# EAGLE design tc_board (EAGLE 9.6.2)

## Sheet 1 of 3
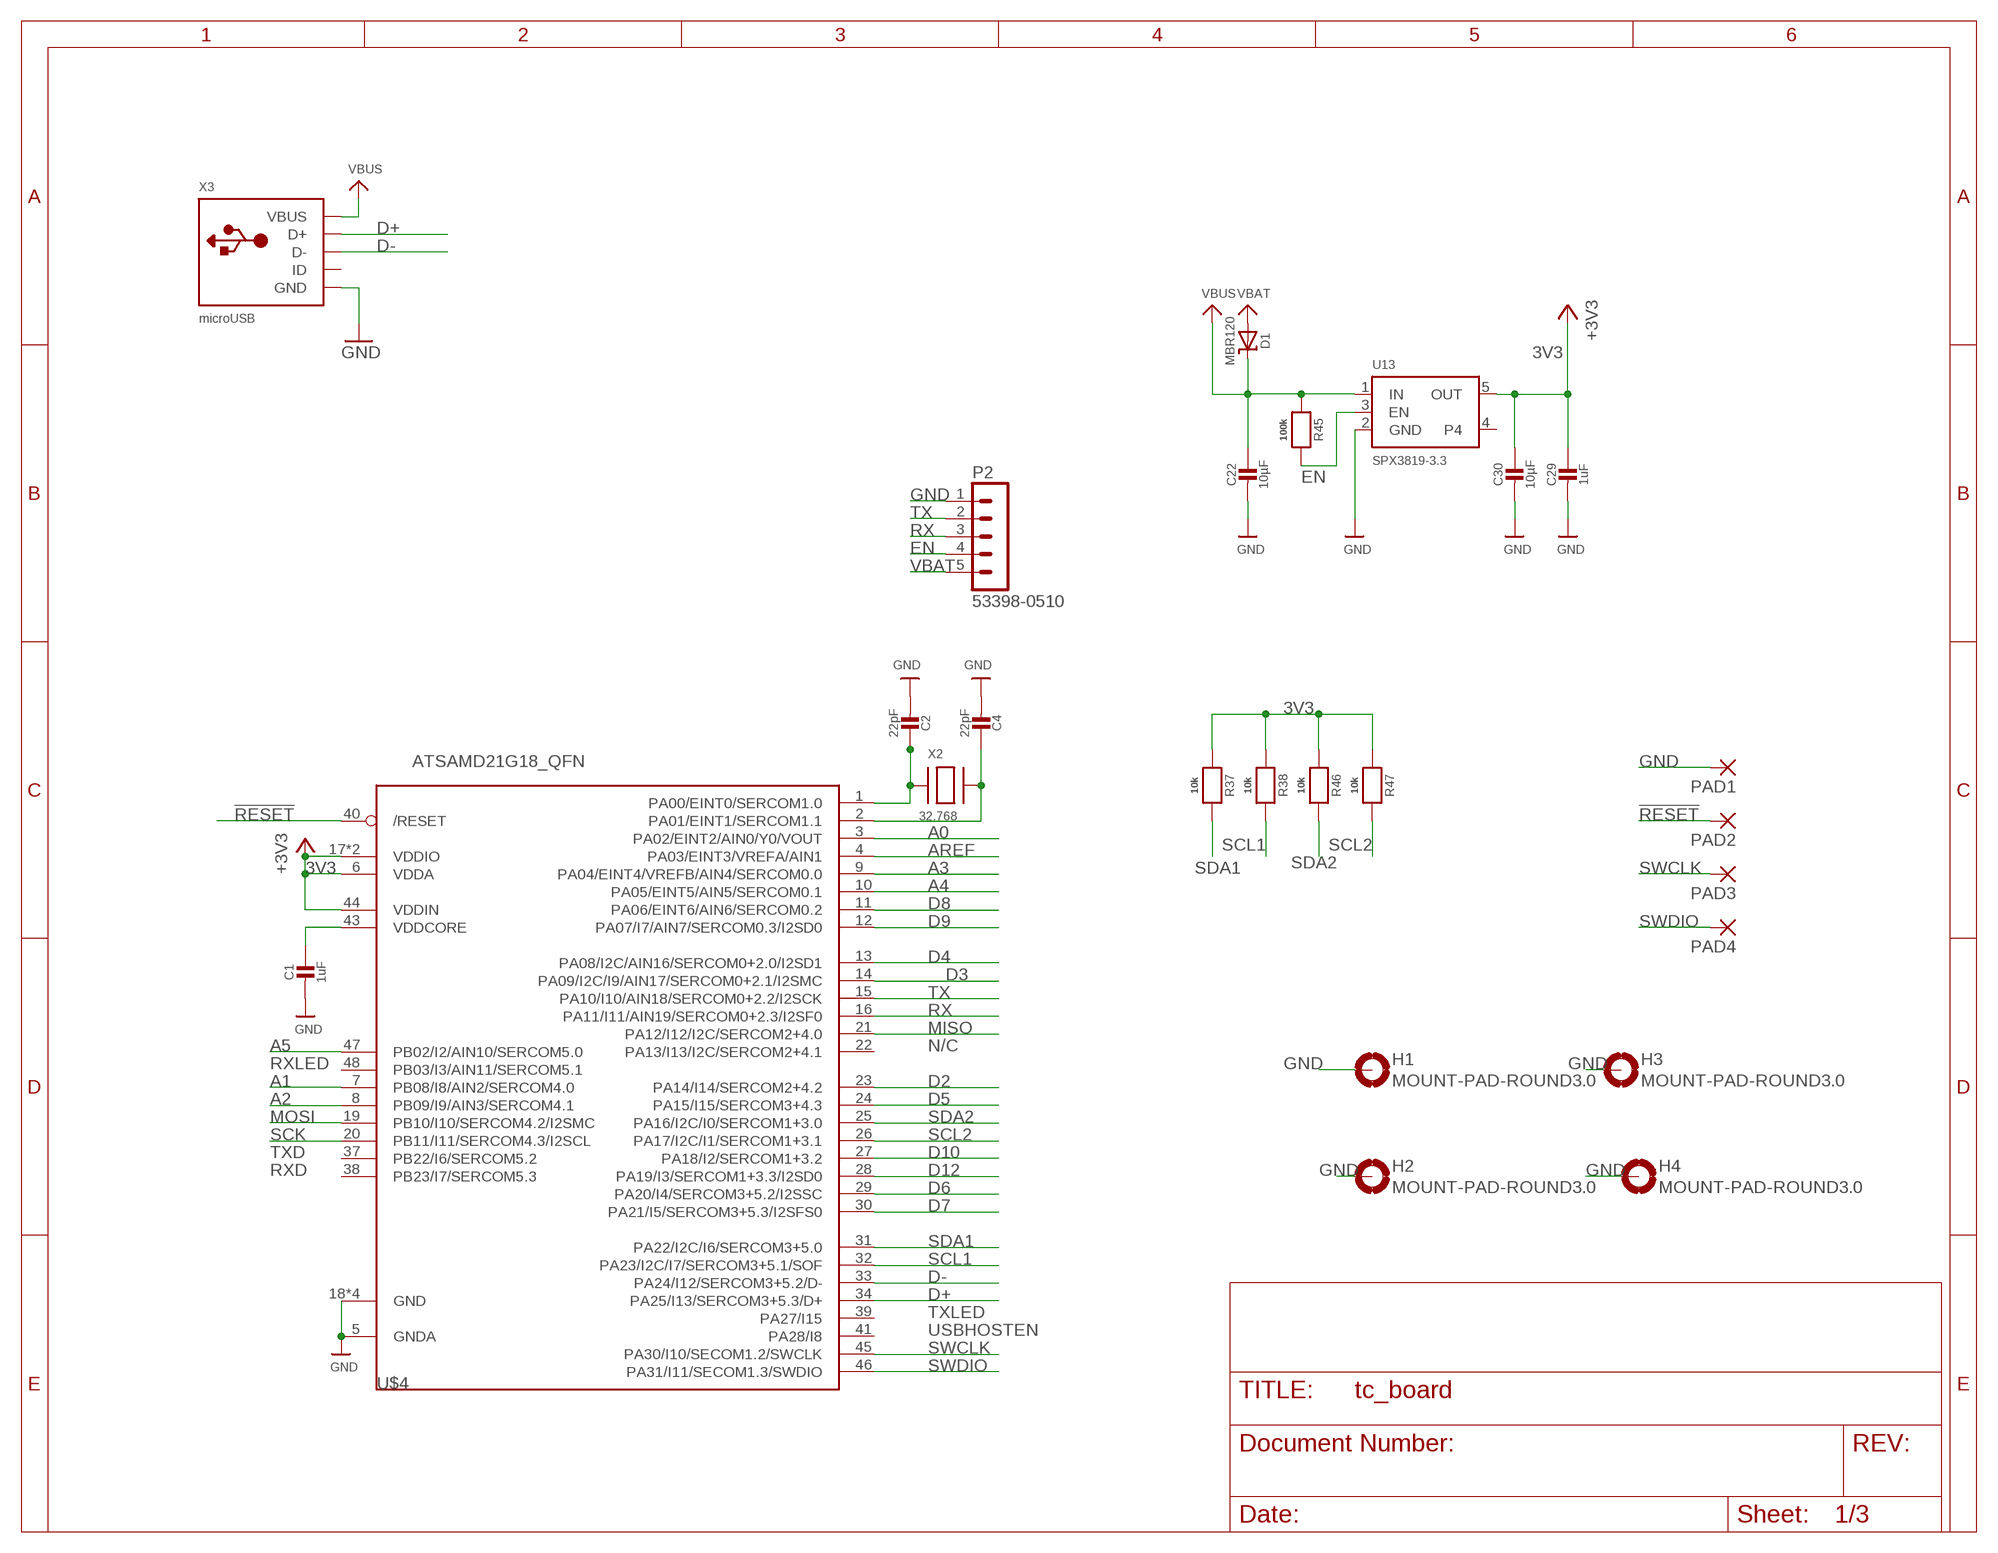
[diagram p0: schematic, sheet 1]

### Parts
C1  1uF  CAP_CERAMIC0603_NO  [0603-NO]
C2  22pF  CAP_CERAMIC0603_NO  [0603-NO]
C4  22pF  CAP_CERAMIC0603_NO  [0603-NO]
C22  10µF  CAP_CERAMIC0805-NOOUTLINE  [0805-NO]
C29  1uF  CAP_CERAMIC0603_NO  [0603-NO]
C30  10µF  CAP_CERAMIC0805-NOOUTLINE  [0805-NO]
D1  MBR120  DIODE-SCHOTTKYSOD-123  [SOD-123]
H1  MOUNT-PAD-ROUND3.0  [3,0-PAD]
H2  MOUNT-PAD-ROUND3.0  [3,0-PAD]
H3  MOUNT-PAD-ROUND3.0  [3,0-PAD]
H4  MOUNT-PAD-ROUND3.0  [3,0-PAD]
P2  53398-0510  [53398-0510]
PAD1  SMD2  [SMD1,27-2,54]
PAD2  SMD2  [SMD1,27-2,54]
PAD3  SMD2  [SMD1,27-2,54]
PAD4  SMD2  [SMD1,27-2,54]
R37  10k  RESISTOR_0603_NOOUT  [0603-NO]
R38  10k  RESISTOR_0603_NOOUT  [0603-NO]
R45  100k  RESISTOR_0603_NOOUT  [0603-NO]
R46  10k  RESISTOR_0603_NOOUT  [0603-NO]
R47  10k  RESISTOR_0603_NOOUT  [0603-NO]
U13  SPX3819-3.3  VREG_SOT23-5  [SOT23-5]
U$4  ATSAMD21G18_QFN  ATSAMD21J_QFN  [TQFN48_7MM]
X2  32.768  XTAL-3.2X1.5  [XTAL3215]
X3  microUSB  USB_MICRO_20329_V2  [4UCONN_20329_V2]

### Nets
3V3: C29.1 C30.1 R37.1 R38.1 R46.1 R47.1 U13.5(OUT) U$4.6(VDDA) U$4.17(VDDIO) U$4.36(VDDIO) U$4.44(VDDIN) ; supply symbol labelled +3V3 ; also sheet 2,3
!RESET: PAD2.1(P) U$4.40(/RESET)
A0: U$4.3(PA02/EINT2/AIN0/Y0/VOUT)
A1: U$4.7(PB08/I8/AIN2/SERCOM4.0)
A2: U$4.8(PB09/I9/AIN3/SERCOM4.1)
A3: U$4.9(PA04/EINT4/VREFB/AIN4/SERCOM0.0)
A4: U$4.10(PA05/EINT5/AIN5/SERCOM0.1)
A5: U$4.47(PB02/I2/AIN10/SERCOM5.0)
AREF: U$4.4(PA03/EINT3/VREFA/AIN1)
D2: U$4.23(PA14/I14/SERCOM2+4.2)
D3: U$4.14(PA09/I2C/I9/AIN17/SERCOM0+2.1/I2SMC)
D4: U$4.13(PA08/I2C/AIN16/SERCOM0+2.0/I2SD1)
D5: U$4.24(PA15/I15/SERCOM3+4.3)
D6: U$4.29(PA20/I4/SERCOM3+5.2/I2SSC)
D7: U$4.30(PA21/I5/SERCOM3+5.3/I2SFS0)
D8: U$4.11(PA06/EINT6/AIN6/SERCOM0.2)
D9: U$4.12(PA07/I7/AIN7/SERCOM0.3/I2SD0)
D10: U$4.27(PA18/I2/SERCOM1+3.2)
D12: U$4.28(PA19/I3/SERCOM1+3.3/I2SD0)
D+: U$4.34(PA25/I13/SERCOM3+5.3/D+) X3.D+
D-: U$4.33(PA24/I12/SERCOM3+5.2/D-) X3.D-
EN: P2.4 R45.2 U13.3(EN)
GND: C1.2 C2.2 C4.2 C22.2 C29.2 C30.2 H1.B3,0(MOUNT) H2.B3,0(MOUNT) H3.B3,0(MOUNT) H4.B3,0(MOUNT) P2.1 PAD1.1(P) U13.2(GND) U$4.5(GNDA) U$4.18(GND) U$4.35(GND) U$4.42(GND) U$4.THERMAL(GND) X3.BASE@1(GND) X3.BASE@2(GND) X3.GND X3.SPRT@1(GND) X3.SPRT@2(GND) X3.SPRT@3(GND) X3.SPRT@4(GND) ; also sheet 2,3
MISO: U$4.21(PA12/I12/I2C/SERCOM2+4.0)
MOSI: U$4.19(PB10/I10/SERCOM4.2/I2SMC)
N$5: C2.1 U$4.1(PA00/EINT0/SERCOM1.0) X2.P$1
N$7: C4.1 U$4.2(PA01/EINT1/SERCOM1.1) X2.P$2
RX: P2.3 U$4.16(PA11/I11/AIN19/SERCOM0+2.3/I2SF0)
SCK: U$4.20(PB11/I11/SERCOM4.3/I2SCL)
SCL1: R38.2 U$4.32(PA23/I2C/I7/SERCOM3+5.1/SOF) ; also sheet 2,3
SCL2: R47.2 U$4.26(PA17/I2C/I1/SERCOM1+3.1) ; also sheet 2,3
SDA1: R37.2 U$4.31(PA22/I2C/I6/SERCOM3+5.0) ; also sheet 2,3
SDA2: R46.2 U$4.25(PA16/I2C/I0/SERCOM1+3.0) ; also sheet 2,3
SWCLK: PAD3.1(P) U$4.45(PA30/I10/SECOM1.2/SWCLK)
SWDIO: PAD4.1(P) U$4.46(PA31/I11/SECOM1.3/SWDIO)
TX: P2.2 U$4.15(PA10/I10/AIN18/SERCOM0+2.2/I2SCK)
VBAT: D1.A P2.5
VBUS: C22.1 D1.C R45.1 U13.1(IN) X3.VBUS
VDDCORE: C1.1 U$4.43(VDDCORE)
Unconnected: U13.4 U$4.22(PA13/I13/I2C/SERCOM2+4.1) U$4.37(PB22/I6/SERCOM5.2) U$4.38(PB23/I7/SERCOM5.3) U$4.39(PA27/I15) U$4.41(PA28/I8) U$4.48(PB03/I3/AIN11/SERCOM5.1) X3.ID

### Notes on the sheet
- N/C
- RXLED
- TXD
- RXD
- TXLED
- USBHOSTEN

## Sheet 2 of 3
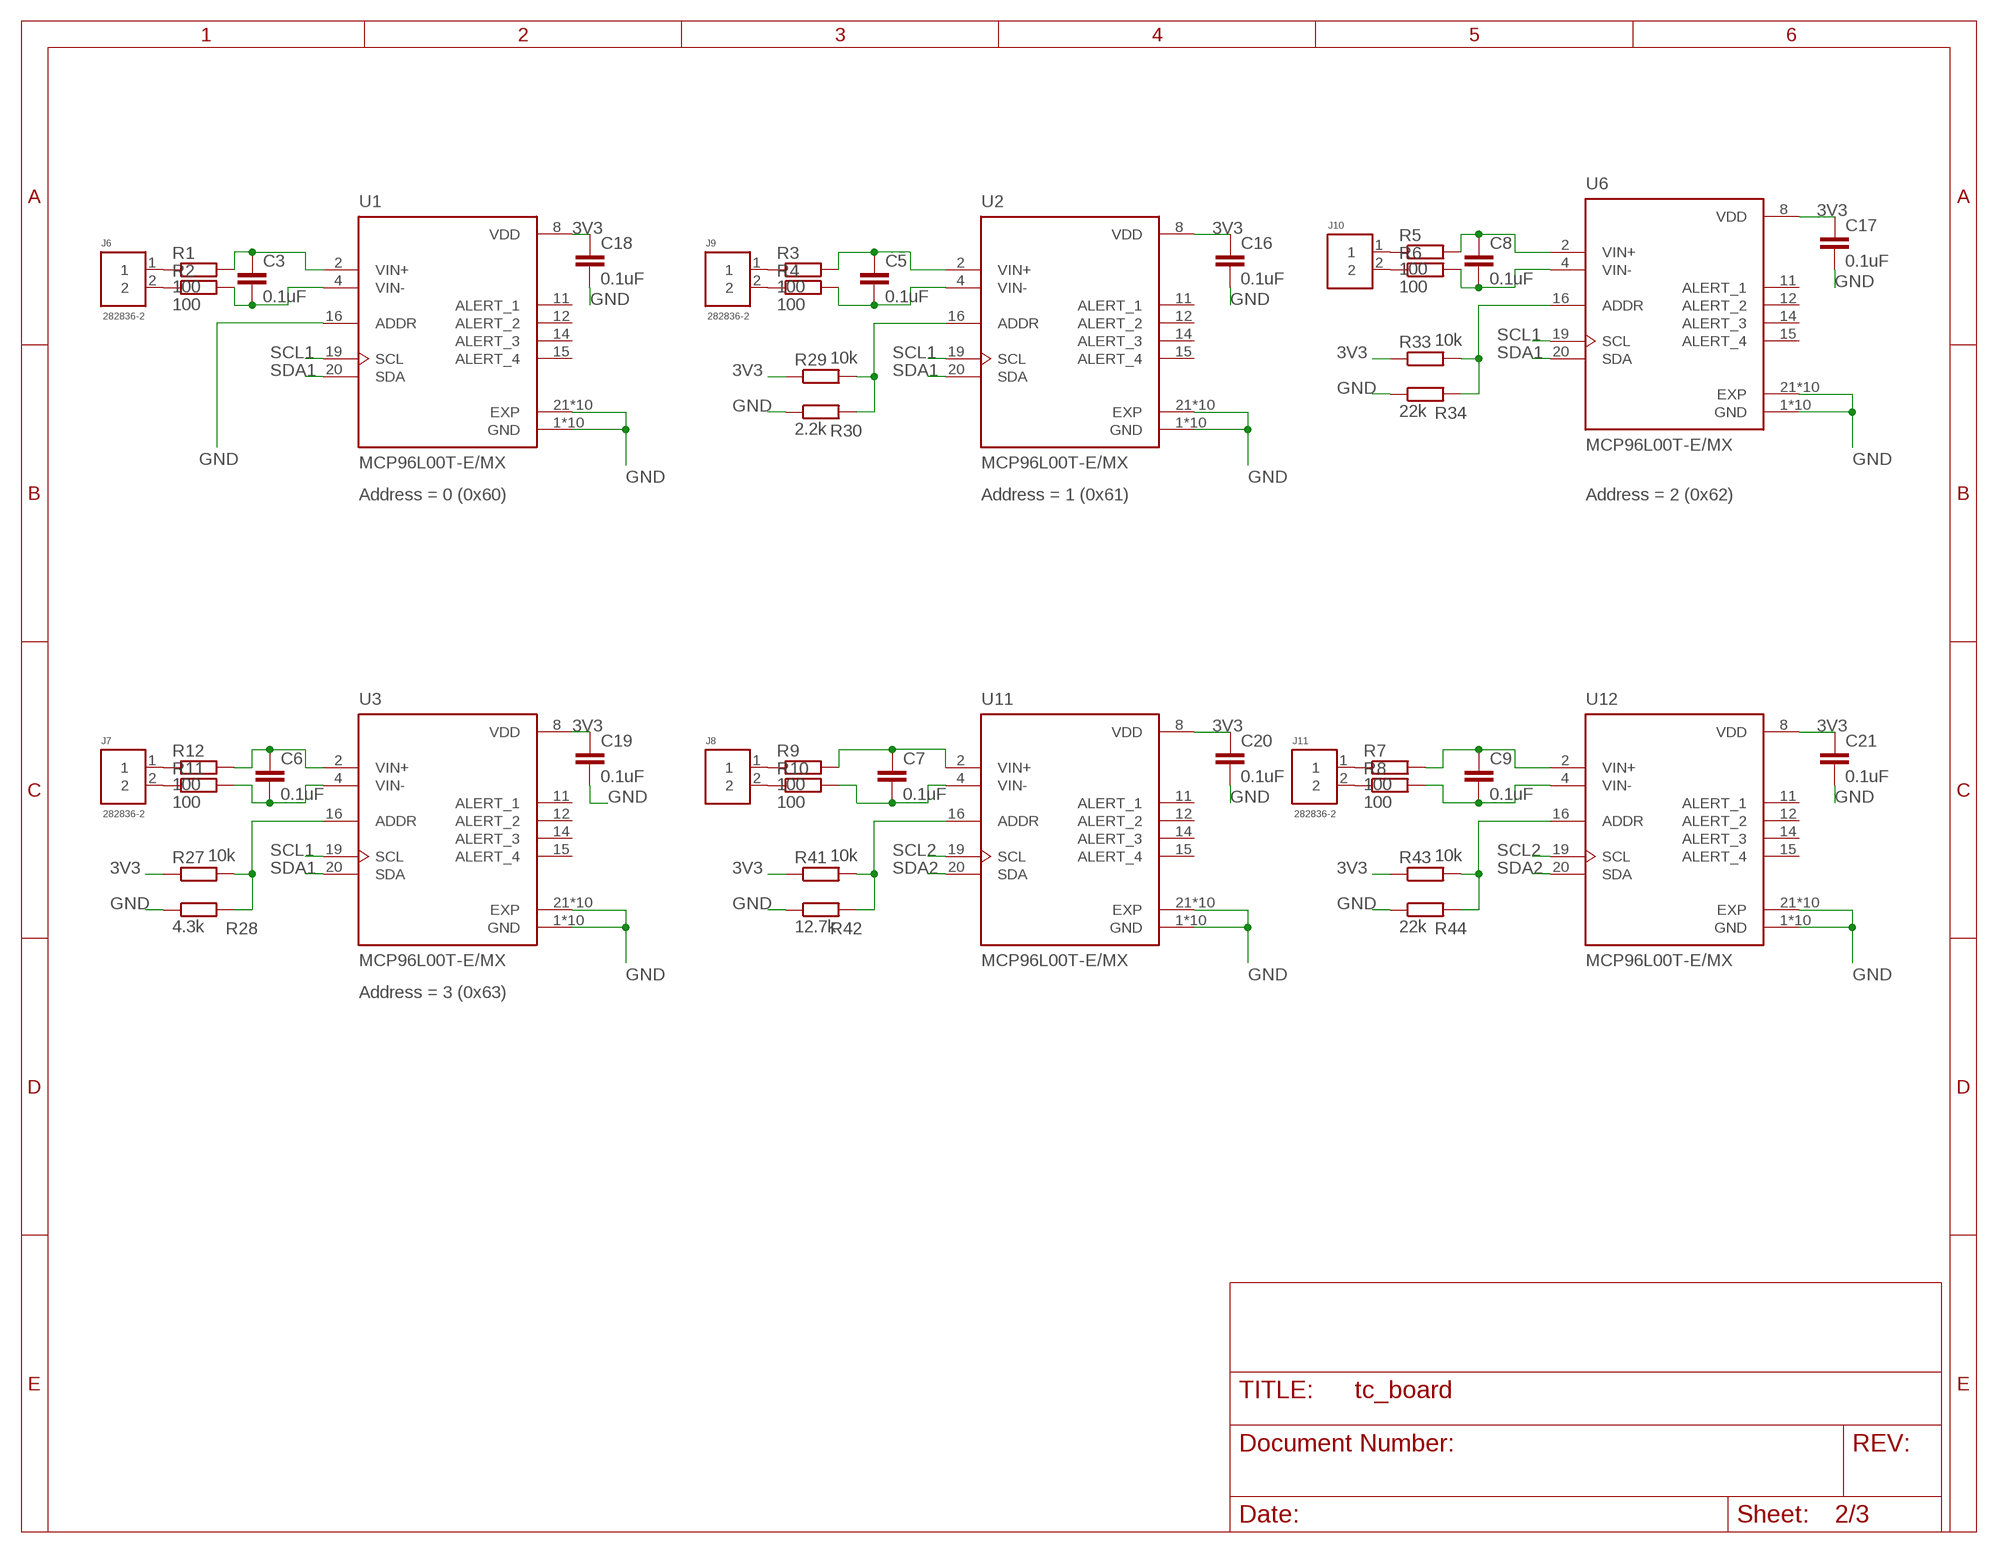
[diagram p1: schematic, sheet 2]

### Parts
C3  0.1uF  C-EUC0603  [C0603]
C5  0.1uF  C-EUC0603  [C0603]
C6  0.1uF  C-EUC0603  [C0603]
C7  0.1uF  C-EUC0603  [C0603]
C8  0.1uF  C-EUC0603  [C0603]
C9  0.1uF  C-EUC0603  [C0603]
C16  0.1uF  C-EUC0603  [C0603]
C17  0.1uF  C-EUC0603  [C0603]
C18  0.1uF  C-EUC0603  [C0603]
C19  0.1uF  C-EUC0603  [C0603]
C20  0.1uF  C-EUC0603  [C0603]
C21  0.1uF  C-EUC0603  [C0603]
J6  282836-2  [CONN_282836-2]
J7  282836-2  [CONN_282836-2]
J8  282836-2  [CONN_282836-2]
J9  282836-2  [CONN_282836-2]
J10  282836-2  [CONN_282836-2]
J11  282836-2  [CONN_282836-2]
R1  100  R-EU_R0603  [R0603]
R2  100  R-EU_R0603  [R0603]
R3  100  R-EU_R0603  [R0603]
R4  100  R-EU_R0603  [R0603]
R5  100  R-EU_R0603  [R0603]
R6  100  R-EU_R0603  [R0603]
R7  100  R-EU_R0603  [R0603]
R8  100  R-EU_R0603  [R0603]
R9  100  R-EU_R0603  [R0603]
R10  100  R-EU_R0603  [R0603]
R11  100  R-EU_R0603  [R0603]
R12  100  R-EU_R0603  [R0603]
R27  10k  R-EU_R0603  [R0603]
R28  4.3k  R-EU_R0603  [R0603]
R29  10k  R-EU_R0603  [R0603]
R30  2.2k  R-EU_R0603  [R0603]
R33  10k  R-EU_R0603  [R0603]
R34  22k  R-EU_R0603  [R0603]
R41  10k  R-EU_R0603  [R0603]
R42  12.7k  R-EU_R0603  [R0603]
R43  10k  R-EU_R0603  [R0603]
R44  22k  R-EU_R0603  [R0603]
U1  MCP96L00T-E/MX  [QFN65P500X500X100-21N_MCP96L00T-E/MX]
U2  MCP96L00T-E/MX  [QFN65P500X500X100-21N_MCP96L00T-E/MX]
U3  MCP96L00T-E/MX  [QFN65P500X500X100-21N_MCP96L00T-E/MX]
U6  MCP96L00T-E/MX  [QFN65P500X500X100-21N_MCP96L00T-E/MX]
U11  MCP96L00T-E/MX  [QFN65P500X500X100-21N_MCP96L00T-E/MX]
U12  MCP96L00T-E/MX  [QFN65P500X500X100-21N_MCP96L00T-E/MX]

### Nets
3V3: C16.1 C17.1 C18.1 C19.1 C20.1 C21.1 R27.1 R29.1 R33.1 R41.1 R43.1 U1.8(VDD) U2.8(VDD) U3.8(VDD) U6.8(VDD) U11.8(VDD) U12.8(VDD) ; also sheet 1,3
GND: C16.2 C17.2 C18.2 C19.2 C20.2 C21.2 R28.1 R30.1 R34.1 R42.1 R44.1 U1.1(GND) U1.3(GND) U1.5(GND) U1.6(GND) U1.7(GND) U1.9(GND) U1.10(GND) U1.13(GND) U1.16(ADDR) U1.17(GND) U1.18(GND) U1.21(EXP) U1.22(EXP) U1.23(EXP) U1.24(EXP) U1.25(EXP) U1.26(EXP) U1.27(EXP) U1.28(EXP) U1.29(EXP) U1.30(EXP) U2.1(GND) U2.3(GND) U2.5(GND) U2.6(GND) U2.7(GND) U2.9(GND) U2.10(GND) U2.13(GND) U2.17(GND) U2.18(GND) U2.21(EXP) U2.22(EXP) U2.23(EXP) U2.24(EXP) U2.25(EXP) U2.26(EXP) U2.27(EXP) U2.28(EXP) U2.29(EXP) U2.30(EXP) U3.1(GND) U3.3(GND) U3.5(GND) U3.6(GND) U3.7(GND) U3.9(GND) U3.10(GND) U3.13(GND) U3.17(GND) U3.18(GND) U3.21(EXP) U3.22(EXP) U3.23(EXP) U3.24(EXP) U3.25(EXP) U3.26(EXP) U3.27(EXP) U3.28(EXP) U3.29(EXP) U3.30(EXP) U6.1(GND) U6.3(GND) U6.5(GND) U6.6(GND) U6.7(GND) U6.9(GND) U6.10(GND) U6.13(GND) U6.17(GND) U6.18(GND) U6.21(EXP) U6.22(EXP) U6.23(EXP) U6.24(EXP) U6.25(EXP) U6.26(EXP) U6.27(EXP) U6.28(EXP) U6.29(EXP) U6.30(EXP) U11.1(GND) U11.3(GND) U11.5(GND) U11.6(GND) U11.7(GND) U11.9(GND) U11.10(GND) U11.13(GND) U11.17(GND) U11.18(GND) U11.21(EXP) U11.22(EXP) U11.23(EXP) U11.24(EXP) U11.25(EXP) U11.26(EXP) U11.27(EXP) U11.28(EXP) U11.29(EXP) U11.30(EXP) U12.1(GND) U12.3(GND) U12.5(GND) U12.6(GND) U12.7(GND) U12.9(GND) U12.10(GND) U12.13(GND) U12.17(GND) U12.18(GND) U12.21(EXP) U12.22(EXP) U12.23(EXP) U12.24(EXP) U12.25(EXP) U12.26(EXP) U12.27(EXP) U12.28(EXP) U12.29(EXP) U12.30(EXP) ; also sheet 1,3
N$6: J6.1 R1.1
N$8: J6.2 R2.1
N$9: J9.1 R3.1
N$10: J9.2 R4.1
N$11: J10.1 R5.1
N$12: J10.2 R6.1
N$13: J11.1 R7.1
N$14: J11.2 R8.1
N$15: J8.1 R9.1
N$16: J8.2 R10.1
N$17: J7.2 R11.1
N$18: J7.1 R12.1
N$19: C6.1 R12.2 U3.2(VIN+)
N$20: C6.2 R11.2 U3.4(VIN-)
N$21: C3.2 R2.2 U1.4(VIN-)
N$23: C3.1 R1.2 U1.2(VIN+)
N$24: C5.1 R3.2 U2.2(VIN+)
N$26: C5.2 R4.2 U2.4(VIN-)
N$27: C8.1 R5.2 U6.2(VIN+)
N$29: C8.2 R6.2 U6.4(VIN-)
N$30: C9.1 R7.2 U12.2(VIN+)
N$31: C9.2 R8.2 U12.4(VIN-)
N$33: C7.2 R10.2 U11.4(VIN-)
N$35: C7.1 R9.2 U11.2(VIN+)
N$52: R27.2 R28.2 U3.16(ADDR)
N$56: R29.2 R30.2 U2.16(ADDR)
N$59: R33.2 R34.2 U6.16(ADDR)
N$63: R41.2 R42.2 U11.16(ADDR)
N$64: R43.2 R44.2 U12.16(ADDR)
SCL1: U1.19(SCL) U2.19(SCL) U3.19(SCL) U6.19(SCL) ; also sheet 1,3
SCL2: U11.19(SCL) U12.19(SCL) ; also sheet 1,3
SDA1: U1.20(SDA) U2.20(SDA) U3.20(SDA) U6.20(SDA) ; also sheet 1,3
SDA2: U11.20(SDA) U12.20(SDA) ; also sheet 1,3
Unconnected: U1.11(ALERT_1) U1.12(ALERT_2) U1.14(ALERT_3) U1.15(ALERT_4) U2.11(ALERT_1) U2.12(ALERT_2) U2.14(ALERT_3) U2.15(ALERT_4) U3.11(ALERT_1) U3.12(ALERT_2) U3.14(ALERT_3) U3.15(ALERT_4) U6.11(ALERT_1) U6.12(ALERT_2) U6.14(ALERT_3) U6.15(ALERT_4) U11.11(ALERT_1) U11.12(ALERT_2) U11.14(ALERT_3) U11.15(ALERT_4) U12.11(ALERT_1) U12.12(ALERT_2) U12.14(ALERT_3) U12.15(ALERT_4)

### Notes on the sheet
- Address = 0 (0x60) | Address = 1 (0x61) | Address = 2 (0x62)
- Address = 3 (0x63)

## Sheet 3 of 3
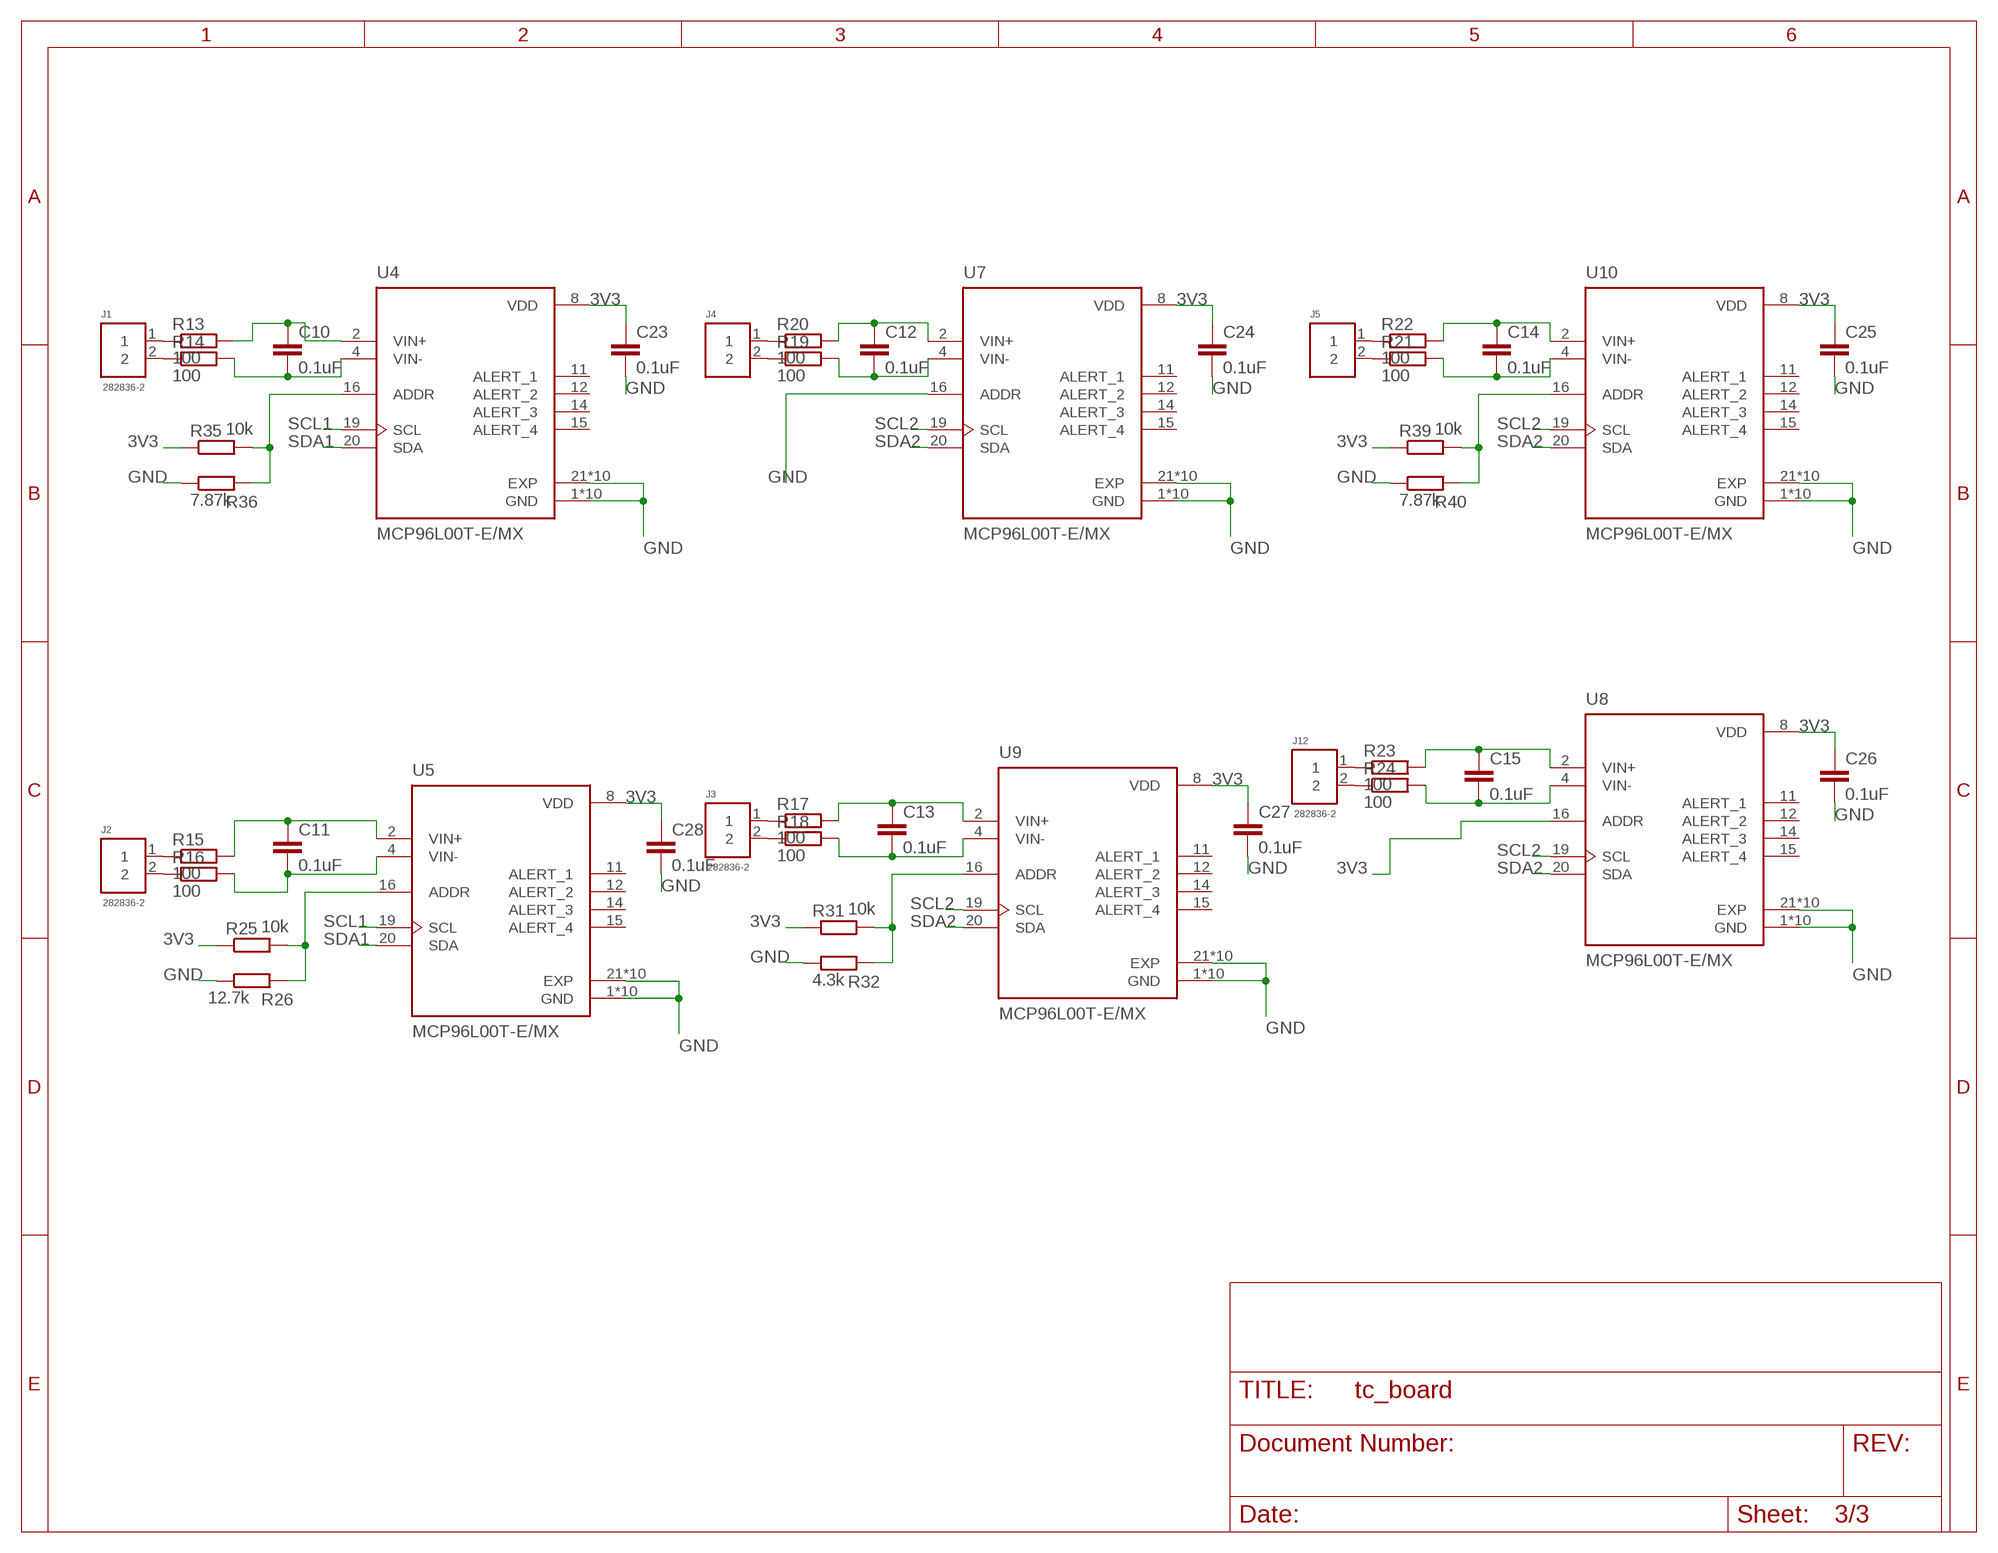
[diagram p2: schematic, sheet 3]

### Parts
C10  0.1uF  C-EUC0603  [C0603]
C11  0.1uF  C-EUC0603  [C0603]
C12  0.1uF  C-EUC0603  [C0603]
C13  0.1uF  C-EUC0603  [C0603]
C14  0.1uF  C-EUC0603  [C0603]
C15  0.1uF  C-EUC0603  [C0603]
C23  0.1uF  C-EUC0603  [C0603]
C24  0.1uF  C-EUC0603  [C0603]
C25  0.1uF  C-EUC0603  [C0603]
C26  0.1uF  C-EUC0603  [C0603]
C27  0.1uF  C-EUC0603  [C0603]
C28  0.1uF  C-EUC0603  [C0603]
J1  282836-2  [CONN_282836-2]
J2  282836-2  [CONN_282836-2]
J3  282836-2  [CONN_282836-2]
J4  282836-2  [CONN_282836-2]
J5  282836-2  [CONN_282836-2]
J12  282836-2  [CONN_282836-2]
R13  100  R-EU_R0603  [R0603]
R14  100  R-EU_R0603  [R0603]
R15  100  R-EU_R0603  [R0603]
R16  100  R-EU_R0603  [R0603]
R17  100  R-EU_R0603  [R0603]
R18  100  R-EU_R0603  [R0603]
R19  100  R-EU_R0603  [R0603]
R20  100  R-EU_R0603  [R0603]
R21  100  R-EU_R0603  [R0603]
R22  100  R-EU_R0603  [R0603]
R23  100  R-EU_R0603  [R0603]
R24  100  R-EU_R0603  [R0603]
R25  10k  R-EU_R0603  [R0603]
R26  12.7k  R-EU_R0603  [R0603]
R31  10k  R-EU_R0603  [R0603]
R32  4.3k  R-EU_R0603  [R0603]
R35  10k  R-EU_R0603  [R0603]
R36  7.87k  R-EU_R0603  [R0603]
R39  10k  R-EU_R0603  [R0603]
R40  7.87k  R-EU_R0603  [R0603]
U4  MCP96L00T-E/MX  [QFN65P500X500X100-21N_MCP96L00T-E/MX]
U5  MCP96L00T-E/MX  [QFN65P500X500X100-21N_MCP96L00T-E/MX]
U7  MCP96L00T-E/MX  [QFN65P500X500X100-21N_MCP96L00T-E/MX]
U8  MCP96L00T-E/MX  [QFN65P500X500X100-21N_MCP96L00T-E/MX]
U9  MCP96L00T-E/MX  [QFN65P500X500X100-21N_MCP96L00T-E/MX]
U10  MCP96L00T-E/MX  [QFN65P500X500X100-21N_MCP96L00T-E/MX]

### Nets
3V3: C23.1 C24.1 C25.1 C26.1 C27.1 C28.1 R25.1 R31.1 R35.1 R39.1 U4.8(VDD) U5.8(VDD) U7.8(VDD) U8.8(VDD) U8.16(ADDR) U9.8(VDD) U10.8(VDD) ; also sheet 1,2
GND: C23.2 C24.2 C25.2 C26.2 C27.2 C28.2 R26.1 R32.1 R36.1 R40.1 U4.1(GND) U4.3(GND) U4.5(GND) U4.6(GND) U4.7(GND) U4.9(GND) U4.10(GND) U4.13(GND) U4.17(GND) U4.18(GND) U4.21(EXP) U4.22(EXP) U4.23(EXP) U4.24(EXP) U4.25(EXP) U4.26(EXP) U4.27(EXP) U4.28(EXP) U4.29(EXP) U4.30(EXP) U5.1(GND) U5.3(GND) U5.5(GND) U5.6(GND) U5.7(GND) U5.9(GND) U5.10(GND) U5.13(GND) U5.17(GND) U5.18(GND) U5.21(EXP) U5.22(EXP) U5.23(EXP) U5.24(EXP) U5.25(EXP) U5.26(EXP) U5.27(EXP) U5.28(EXP) U5.29(EXP) U5.30(EXP) U7.1(GND) U7.3(GND) U7.5(GND) U7.6(GND) U7.7(GND) U7.9(GND) U7.10(GND) U7.13(GND) U7.16(ADDR) U7.17(GND) U7.18(GND) U7.21(EXP) U7.22(EXP) U7.23(EXP) U7.24(EXP) U7.25(EXP) U7.26(EXP) U7.27(EXP) U7.28(EXP) U7.29(EXP) U7.30(EXP) U8.1(GND) U8.3(GND) U8.5(GND) U8.6(GND) U8.7(GND) U8.9(GND) U8.10(GND) U8.13(GND) U8.17(GND) U8.18(GND) U8.21(EXP) U8.22(EXP) U8.23(EXP) U8.24(EXP) U8.25(EXP) U8.26(EXP) U8.27(EXP) U8.28(EXP) U8.29(EXP) U8.30(EXP) U9.1(GND) U9.3(GND) U9.5(GND) U9.6(GND) U9.7(GND) U9.9(GND) U9.10(GND) U9.13(GND) U9.17(GND) U9.18(GND) U9.21(EXP) U9.22(EXP) U9.23(EXP) U9.24(EXP) U9.25(EXP) U9.26(EXP) U9.27(EXP) U9.28(EXP) U9.29(EXP) U9.30(EXP) U10.1(GND) U10.3(GND) U10.5(GND) U10.6(GND) U10.7(GND) U10.9(GND) U10.10(GND) U10.13(GND) U10.17(GND) U10.18(GND) U10.21(EXP) U10.22(EXP) U10.23(EXP) U10.24(EXP) U10.25(EXP) U10.26(EXP) U10.27(EXP) U10.28(EXP) U10.29(EXP) U10.30(EXP) ; also sheet 1,2
N$22: J1.1 R13.1
N$25: J1.2 R14.1
N$28: J12.1 R23.1
N$32: C10.1 R13.2 U4.2(VIN+)
N$34: C10.2 R14.2 U4.4(VIN-)
N$36: J2.1 R15.1
N$37: J2.2 R16.1
N$38: J3.1 R17.1
N$39: J3.2 R18.1
N$40: J4.2 R19.1
N$41: J4.1 R20.1
N$42: J5.2 R21.1
N$43: J5.1 R22.1
N$44: J12.2 R24.1
N$45: C12.1 R20.2 U7.2(VIN+)
N$46: C12.2 R19.2 U7.4(VIN-)
N$47: C15.1 R23.2 U8.2(VIN+)
N$48: C14.2 R21.2 U10.4(VIN-)
N$49: C15.2 R24.2 U8.4(VIN-)
N$50: C14.1 R22.2 U10.2(VIN+)
N$51: C13.1 R17.2 U9.2(VIN+)
N$53: C13.2 R18.2 U9.4(VIN-)
N$54: C11.1 R15.2 U5.2(VIN+)
N$55: C11.2 R16.2 U5.4(VIN-)
N$57: R25.2 R26.2 U5.16(ADDR)
N$58: R31.2 R32.2 U9.16(ADDR)
N$60: R35.2 R36.2 U4.16(ADDR)
N$62: R39.2 R40.2 U10.16(ADDR)
SCL1: U4.19(SCL) U5.19(SCL) ; also sheet 1,2
SCL2: U7.19(SCL) U8.19(SCL) U9.19(SCL) U10.19(SCL) ; also sheet 1,2
SDA1: U4.20(SDA) U5.20(SDA) ; also sheet 1,2
SDA2: U7.20(SDA) U8.20(SDA) U9.20(SDA) U10.20(SDA) ; also sheet 1,2
Unconnected: U4.11(ALERT_1) U4.12(ALERT_2) U4.14(ALERT_3) U4.15(ALERT_4) U5.11(ALERT_1) U5.12(ALERT_2) U5.14(ALERT_3) U5.15(ALERT_4) U7.11(ALERT_1) U7.12(ALERT_2) U7.14(ALERT_3) U7.15(ALERT_4) U8.11(ALERT_1) U8.12(ALERT_2) U8.14(ALERT_3) U8.15(ALERT_4) U9.11(ALERT_1) U9.12(ALERT_2) U9.14(ALERT_3) U9.15(ALERT_4) U10.11(ALERT_1) U10.12(ALERT_2) U10.14(ALERT_3) U10.15(ALERT_4)

## Library data of the parts
C1 C2 C4 C22 C29 C30 = microbuilder:CAP_CERAMIC: Ceramic Capacitors For new designs, use the packages preceded by an '_' character since they are more reliable: The following footprints should be used on most boards: _0402 - Standard footprint for regular board layouts _0603 - Standard footprint for regular board layouts _0805 - Standard footprint for regular board layouts _1206 - Standard footprint for regular board layouts For extremely tight-pitch boards where space is at a premium, the following 'micro-pitch' footprints can be used (smaller pads, no silkscreen outline, etc.): _0402MP - Micro-pitch footprint for very dense/compact boards _0603MP - Micro-pitch footprint for very dense/compact boards _0805MP - Micro-pitch footprint for very dense/compact boards _1206MP - Micro-pitch footprint for very dense/compact boards
C3 C5-C21 C23-C28 = rcl:C-EU: CAPACITOR, European symbol; SPICEPREFIX: C
D1 = microbuilder:DIODE-SCHOTTKY
H1-H4 = holes:MOUNT-PAD-ROUND: MOUNTING PAD, round
J1-J12 = 282836-2:282836-2: TERM BLOCK 2POS SIDE ENTRY 5MM; DESCRIPTION: Conn Eurostyle Block 2 POS 5mm Solder ST Thru-Hole 13.5A/Contact; MF: TE Connectivity; MP: 2828362; PACKAGE: None
P2 = con-molex-picoblade:53398-0510: HEADER
PAD1-PAD4 = wirepad:SMD2: SMD PAD
R1-R36 R39-R44 = rcl:R-EU_: RESISTOR, European symbol; SPICEPREFIX: R
R37 R38 R45-R47 = microbuilder:RESISTOR: Resistors For new designs, use the packages preceded by an '_' character since they are more reliable: The following footprints should be used on most boards: _0402 - Standard footprint for regular board layouts _0603 - Standard footprint for regular board layouts _0805 - Standard footprint for regular board layouts _1206 - Standard footprint for regular board layouts For extremely tight-pitch boards where space is at a premium, the following 'micro-pitch' footprints can be used (smaller pads, no silkscreen outline, etc.): _0402MP - Micro-pitch footprint for very dense/compact boards _0603MP - Micro-pitch footprint for very dense/compact boards _0805MP - Micro-pitch footprint for very dense/compact boards _1206MP - Micro-pitch footprint for very dense/compact boards
U1-U12 = MCP96L00T-E_MX:MCP96L00T-E/MX: MCP9600 Series Thermocouple Electromotive Force to ±1.5°C Converter - VQFN-2; DESCRIPTION: +/- 4.0C THERMOCOUPLE TO I2C CON; DIGI-KEY_PART_NUMBER: MCP96L00T-E/MXCT-ND; MF: Microchip Technology; MP: MCP96L00T-E/MX; PACKAGE: VQFN-20 Microchip; PURCHASE-URL: https://pricing.snapeda.com/search/part/MCP96L00T-E/MX/?ref=eda
U13 = microbuilder:VREG_SOT23-5: SOT23-5 Fixed Voltage Regulators Part Current Out V Out V In V Dropout θJA (°C/W) TJ (°C) Digikey Part No. ADP121 150mA 3.3V 3.4-5.5V 0.09V @ 150mA -- -- ADP121-AUJZ33R7CT-ND ADP121 150mA 3.0V 3.1-5.5V 0.09V @ 150mA -- -- ADP121-AUJZ30R7CT-ND ADP122 300mA 3.3V 3.4-5.5V 0.085V @ 300mA -- -- ADP122AUJZ-3.3-R7CT-ND ADP1712 300mA 3.3V 3.5-5.5V 0.17V @ 300mA -- -- ADP1712AUJZ-3.3-R7TR-ND AP7311 (Low Cost) 150mA 3.3V 3.5-6V 0.15V @ 150mA -- -- AP7311-33WG-7DICT-ND LD39015M18R 150mA 1.8V 1.9V-5.5V 0.08V @ 100mA -- -- 497-6977-1-ND LP2985A-33DBVR 150mA 3.3V 3.3-16V 0.28V @ 150mA 206 150 296-18479-1-ND MCP1824T-3302E/OT 300mA 3.3V 3.5V-6V 0.2V @ 300mA -- -- MCP1824T-3302E/OTCT-ND MIC5205-2.5YM5 TR 150mA 2.5V 2.7-16V 0.165V @ 150mA -- -- 576-1257-2-ND MIC5205-3.0YM5 TR 150mA 3.0V 3.2V-16V 0.165V @ 150mA -- -- 576-1258-2-ND MIC5205-3.3YM5 TR 150mA 3.3V 3.5V-16V 0.165V @ 150mA -- -- 576-1259-2-ND TPS780330220 150mA 3.3V+2.2V 3.6-5.5V 250mV Max -- -- 296-23332-1-ND TDA3663/N1,135 100mA 3.3V 3.5-45V 0.18V @ 50mA -- -- 568-5343-1-ND Max operating temp can be calculated using θJA, TJ (max junction temperature), and power in watts. Set the "Maximum Ambient Temperature" until it reaches TJ ("Max Junction Temperature"), which is the absolute limit for safe use of the regulator: Heat Sink Temperature Calculator <http://www.daycounter.com/Calculators/Heat-Sink-Temperature-Calculator.phtml> For example, With 12V source into a 3.3V LP2985 and a 30mA load, we are dissipating (12V-3.3V) * 0.03A = 0.261W. With a θJA of 206 °C/W, a TJ of 150°C, and 261mW we can safely use the chip without a heat sink up to 75°C (=147.1°C Junction Temperature).
U$4 = microbuilder:ATSAMD21J
X2 = adafruit2:XTAL: Low cost SMT crystals, no capacitors included http://www.ladyada.net/library/eagle
X3 = microbuilder:USB: USB Connectors USBMINIB - Surface Mount Female Mini-B USB Connector 4UConnector: 06564

## Board
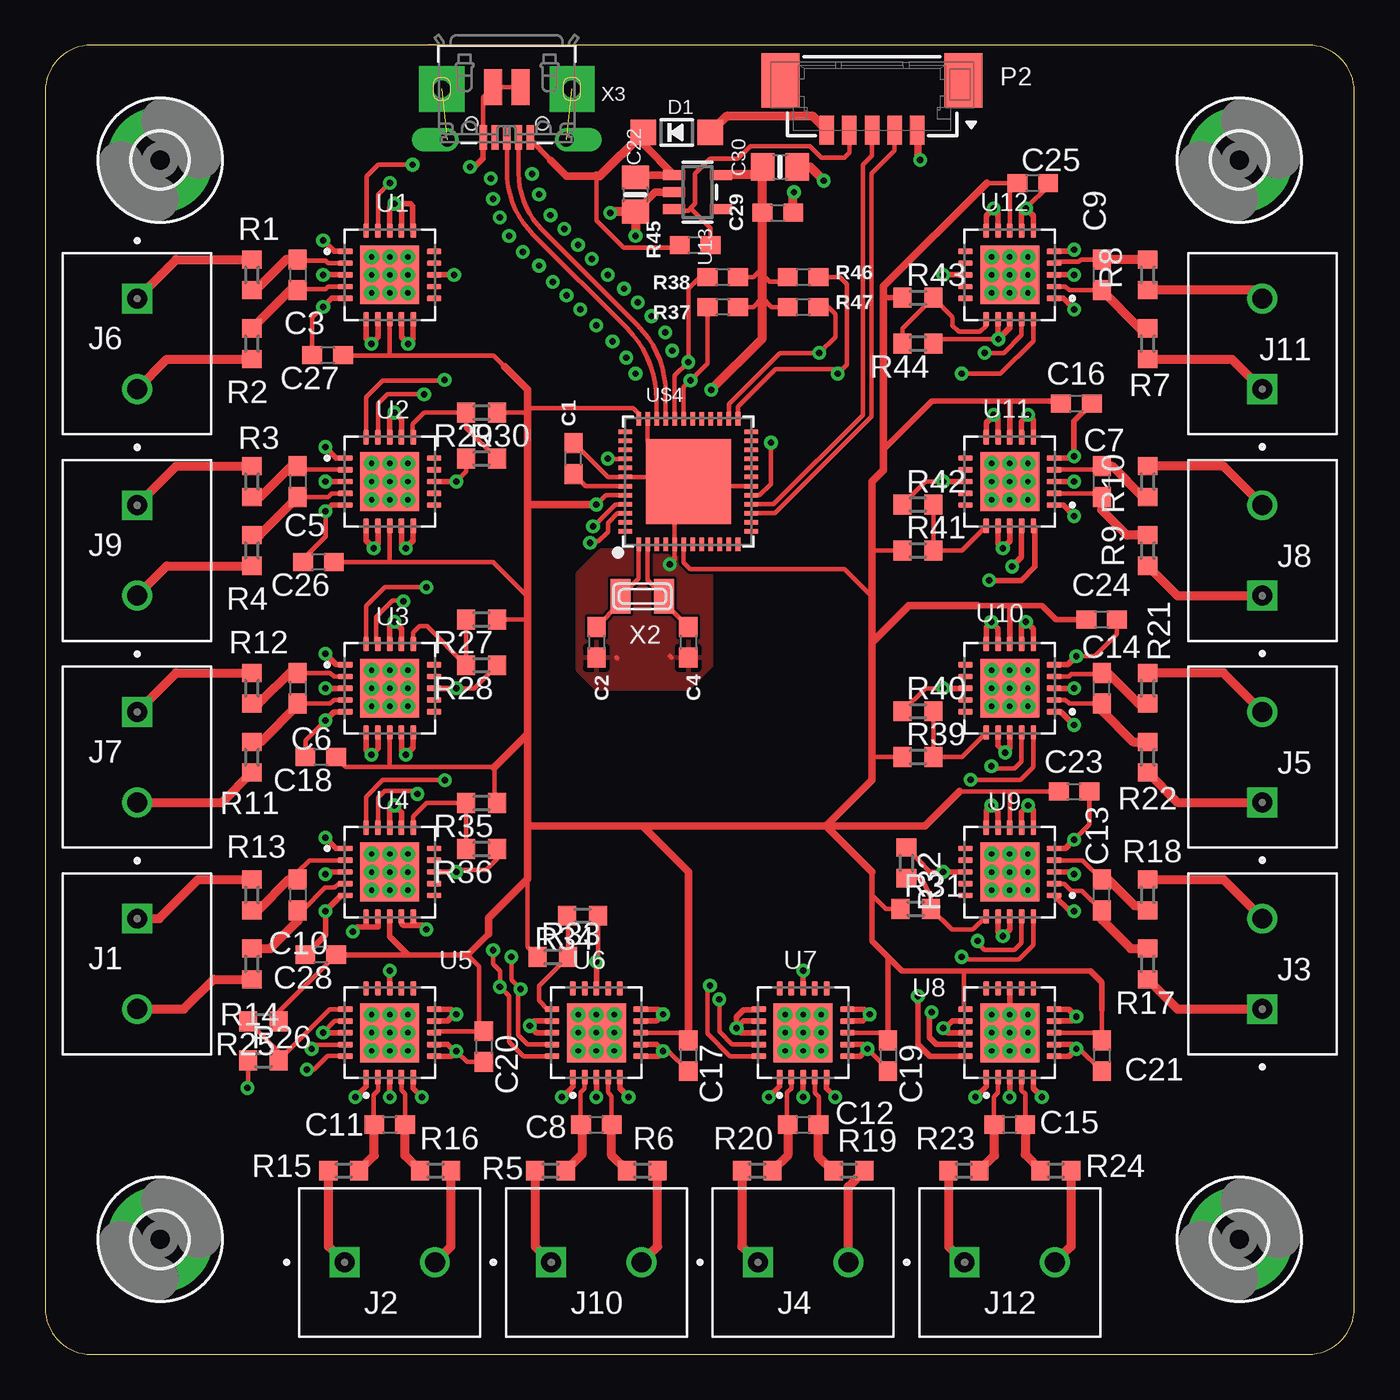
[diagram p3: board, top side]
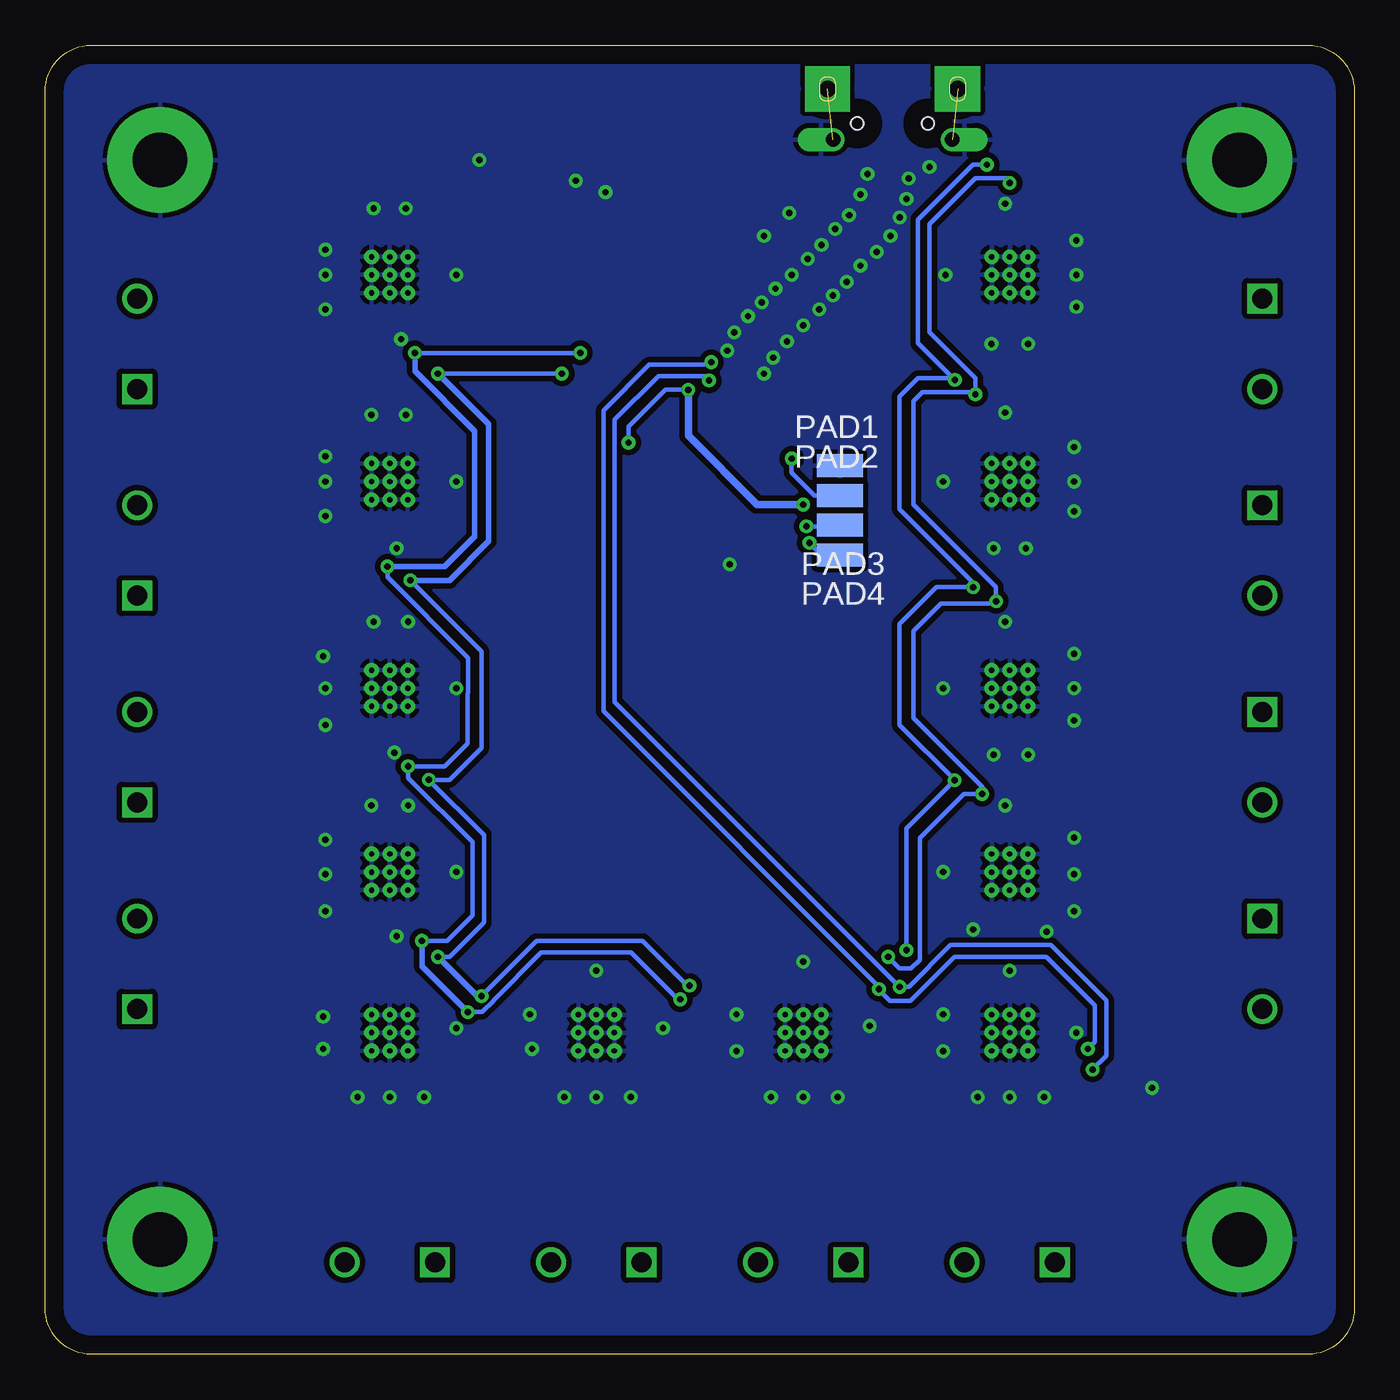
[diagram p4: board, bottom side, seen from below]

Size 72.39 x 72.39 mm. Coordinates in mm from the lower left corner, seen from the top.
Outline: 72.39,2.54 72.39,69.85 arc90 69.85,72.39 2.54,72.39 arc90 0,69.85 0,2.54 arc90 2.54,0 69.85,0 arc90 72.39,2.54
Copper layers (1*16): Top 0.035mm / dielectric 1.5mm / Bottom 0.035mm
Design rules "default *": minimum track width 6mil, minimum drill 0.35mm, track to track 6mil, track to pad 6mil, pad to pad 6mil, via to via 6mil, smd to smd 6mil, copper to edge 40mil, drill to drill 6mil, minimum pad ring 10mil, minimum via ring 8mil, stop-mask expansion 4mil, vias tented up to drill 20mil, thermal gap 10mil

### Footprints (pad centres in the part's own frame; a part is rotated, then mirrored left to right if it is on the bottom)
0603-NO = smd 1.1 x 1: 1 -0.85,0; 2 0.85,0
C0603 = smd 1.1 x 1: 1 -0.85,0; 2 0.85,0
0805-NO = smd 1.3 x 1.5: 1 -0.95,0; 2 0.95,0
SOD-123 = smd 1.4 x 1.4: A 1.85,0; C -1.85,0
3,0-PAD = drill 3 pad 5.842: B3,0 0,0
CONN_282836-2 = drill 1.1 square: 1 -2.5,0 | drill 1.1: 2 2.5,0
53398-0510 = smd 0.8 x 1.6: 1 2.5,0; 2 1.25,0; 3 0,0; 4 -1.25,0; 5 -2.5,0 | smd 2.1 x 3: M1 5.06,2.75; M2 -5.06,2.75
SMD1,27-2,54 = smd 1.27 x 2.54: 1 0,0
R0603 = smd 1 x 1.1: 1 -0.85,0; 2 0.85,0
QFN65P500X500X100-21N_MCP96L00T-E/MX = smd 0.81 x 0.32: 1 -2.45,1.3; 2 -2.45,0.65; 3 -2.45,0; 4 -2.45,-0.65; 5 -2.45,-1.3; 11 2.45,-1.3; 12 2.45,-0.65; 13 2.45,0; 14 2.45,0.65; 15 2.45,1.3 | smd 0.32 x 0.81: 6 -1.3,-2.45; 7 -0.65,-2.45; 8 0,-2.45; 9 0.65,-2.45; 10 1.3,-2.45; 16 1.3,2.45; 17 0.65,2.45; 18 0,2.45; 19 -0.65,2.45; 20 -1.3,2.45 | smd 3.25 x 3.25: 21 0,0 | drill 0.3 pad 0.5: 22 -1,1; 23 0,1; 24 1,1; 25 -1,0; 26 0,0; 27 1,0; 28 -1,-1; 29 0,-1; 30 1,-1
SOT23-5 = smd 0.55 x 1.2: 1 -0.95,-1.3; 2 0,-1.3; 3 0.95,-1.3; 4 0.95,1.3; 5 -0.95,1.3
TQFN48_7MM = smd 0.25 x 0.75: 1 -2.75,-3.475; 2 -2.25,-3.475; 3 -1.75,-3.475; 4 -1.25,-3.475; 5 -0.75,-3.475; 6 -0.25,-3.475; 7 0.25,-3.475; 8 0.75,-3.475; 9 1.25,-3.475; 10 1.75,-3.475; 11 2.25,-3.475; 12 2.75,-3.475; 25 2.75,3.475; 26 2.25,3.475; 27 1.75,3.475; 28 1.25,3.475; 29 0.75,3.475; 30 0.25,3.475; 31 -0.25,3.475; 32 -0.75,3.475; 33 -1.25,3.475; 34 -1.75,3.475; 35 -2.25,3.475; 36 -2.75,3.475 | smd 0.75 x 0.25: 13 3.475,-2.75; 14 3.475,-2.25; 15 3.475,-1.75; 16 3.475,-1.25; 17 3.475,-0.75; 18 3.475,-0.25; 19 3.475,0.25; 20 3.475,0.75; 21 3.475,1.25; 22 3.475,1.75; 23 3.475,2.25; 24 3.475,2.75; 37 -3.475,2.75; 38 -3.475,2.25; 39 -3.475,1.75; 40 -3.475,1.25; 41 -3.475,0.75; 42 -3.475,0.25; 43 -3.475,-0.25; 44 -3.475,-0.75; 45 -3.475,-1.25; 46 -3.475,-1.75; 47 -3.475,-2.25; 48 -3.475,-2.75 | smd 4.7 x 4.7: THERMAL 0,0
XTAL3215 = smd 1.1 x 1.9: P$1 1.2,0; P$2 -1.2,0
4UCONN_20329_V2 = smd 1 x 2: BASE@1 -0.75,-2; BASE@2 0.75,-2 | smd 0.4 x 1.35: D+ 0,0.775; D- -0.65,0.775; GND 1.3,0.775; ID 0.65,0.775; VBUS -1.3,0.775 | drill 0.8 pad 1.2 offset: SPRT@1 -3.3,0.9; SPRT@2 3.3,0.9 | drill 0.9 pad 2.5 square: SPRT@3 -3.6,-1.9; SPRT@4 3.6,-1.9 | hole 0.7: -1.95,0; 1.95,0

### Placement (x,y rotation side)
C1  29.21,49.53 90 top
C2  30.48,39.37 270 top
C3  13.97,59.69 270 top
C4  35.56,39.37 270 top
C5  13.97,48.26 270 top
C6  13.97,36.83 270 top
C7  58.42,48.26 90 top
C8  30.48,12.7 0 top
C9  58.42,59.69 90 top
C10  13.97,25.4 270 top
C11  19.05,12.7 0 top
C12  41.91,12.7 0 top
C13  58.42,25.4 90 top
C14  58.42,36.83 90 top
C15  53.34,12.7 0 top
C16  57.02,52.58 0 top
C17  35.56,16.51 270 top
C18  15.24,33.02 180 top
C19  46.61,16.51 270 top
C20  24.26,17.02 270 top
C21  58.42,16.51 270 top
C22  32.64,64.14 270 top
C23  56.9,31.11 0 top
C24  58.42,40.64 0 top
C25  54.61,64.77 0 top
C26  15.11,43.81 180 top
C27  15.62,55.24 180 top
C28  15.24,22.1 180 top
C29  40.51,63.12 0 top
C30  40.64,65.66 0 top
D1  34.92,67.56 0 top
H1  6.35,6.35 0 top
H2  6.35,66.04 0 top
H3  66.04,6.35 0 top
H4  66.04,66.04 0 top
J1  5.08,21.59 270 top
J2  19.05,5.08 0 top
J3  67.31,21.59 90 top
J4  41.91,5.08 0 top
J5  67.31,33.02 90 top
J6  5.08,55.88 270 top
J7  5.08,33.02 270 top
J8  67.31,44.45 90 top
J9  5.08,44.45 270 top
J10  30.48,5.08 0 top
J11  67.31,55.88 90 top
J12  53.34,5.08 0 top
P2  45.72,67.69 0 top
PAD1  28.45,49.15 270 bottom
PAD2  28.45,47.5 270 bottom
PAD3  28.45,45.85 90 bottom
PAD4  28.45,44.2 90 bottom
R1  11.43,59.69 270 top
R2  11.43,55.88 90 top
R3  11.43,48.26 270 top
R4  11.43,44.45 90 top
R5  27.94,10.16 0 top
R6  33.02,10.16 180 top
R7  60.96,55.88 90 top
R8  60.96,59.69 90 top
R9  60.96,44.45 90 top
R10  60.96,48.26 270 top
R11  11.43,33.02 90 top
R12  11.43,36.83 270 top
R13  11.43,25.4 270 top
R14  11.43,21.59 90 top
R15  16.51,10.16 0 top
R16  21.59,10.16 180 top
R17  60.96,21.59 90 top
R18  60.96,25.4 270 top
R19  44.45,10.16 180 top
R20  39.37,10.16 0 top
R21  60.96,36.83 270 top
R22  60.96,33.02 90 top
R23  50.8,10.16 0 top
R24  55.88,10.16 180 top
R25  12.06,18.41 180 top
R26  12.06,16.26 0 top
R27  24.13,40.64 180 top
R28  24.13,38.1 180 top
R29  24.13,52.07 180 top
R30  24.13,49.53 0 top
R31  48.13,24.64 0 top
R32  47.62,27.18 270 top
R33  28.07,21.97 0 top
R34  29.72,24.26 180 top
R35  24.13,30.48 180 top
R36  24.13,27.94 180 top
R37  37.47,57.91 180 top
R38  37.47,59.56 180 top
R39  48.26,33.02 0 top
R40  48.26,35.56 0 top
R41  48.26,44.45 0 top
R42  48.26,46.99 0 top
R43  48.26,58.42 0 top
R44  48.26,55.88 180 top
R45  35.94,61.34 0 top
R46  41.91,59.56 0 top
R47  41.91,57.91 0 top
U1  19.05,59.69 0 top
U2  19.05,48.26 0 top
U3  19.05,36.83 0 top
U4  19.05,26.67 0 top
U5  19.05,17.78 90 top
U6  30.48,17.78 90 top
U7  41.91,17.78 90 top
U8  53.34,17.78 90 top
U9  53.34,26.67 180 top
U10  53.34,36.83 180 top
U11  53.34,48.26 180 top
U12  53.34,59.69 180 top
U13  36.07,64.26 270 top
U$4  35.56,48.26 0 top
X2  33.02,41.91 180 top
X3  25.53,68.07 180 top

### Tracks (layer width: path | path; a pad name or v marks a point on that pad's centre or on a via)
3V3  (via drill 0.35)
  Top 0.254: 26.67,52.07 R29.1 | 16.38,43.81 C26.1 19.05,43.81 | 26.67,40.64 R27.1 | U$4.36 32.81,52.03 32.51,52.32 26.67,52.32 | U$4.44 31,47.51 30.87,47.38 | 30.87,47.38 30.86,47.38 | 30.87,47.38 v30.48,46.99 | C23.1 53.34,31.11 | 53.34,31.11 50.55,31.11 | U9.8 53.34,31.11 | U7.8 46.19,17.78 C19.1 46.61,17.27 | C21.1 58.42,17.78 | 58.42,17.78 58.42,19.05 | U8.8 58.42,17.78 | 35.56,17.78 C17.1 35.14,17.78 U6.8 | U5.8 21.59,17.87 C20.1 24,18.12 24,21.46 23.37,22.1 | R33.1 26.67,22.52 26.67,26.29 | U8.16 50.8,19.17 50.8,21.21 | C28.1 12.91,18.92 R25.1 | 25.4,33.02 24.87,32.49 19.05,32.49 | 19.05,32.49 16.62,32.49 C18.1 | U3.8 19.05,32.49 | R35.1 24.85,30.61 24.85,32.42 24.83,32.45 | 26.67,41.91 24.77,43.81 19.05,43.81 | U2.8 19.05,43.81 | U$4.6 35.31,43.77 35.65,43.43 44.2,43.43 45.72,41.91 | R41.1 45.72,44.45 | 19.05,55.22 16.49,55.22 C27.1 | 25.4,54.61 24.79,55.22 19.05,55.22 | U1.8 19.05,55.22 | R39.1 45.72,33.02 | R31.1 46.48,24.64 45.72,25.4 | 52.07,64.77 C25.1 53.34,64.35 U12.8 | U$4.17 39.51,47.51 40.13,48.13 v40.13,50.42 | 38.44,59.69 R38.1 39.16,59.56 39.66,60.07 | R37.1 39.16,57.91 39.66,58.42 40.17,57.91 R47.1 | R46.1 40.81,59.31 40.04,59.31 39.66,59.69
  Top 0.305: 46.35,50.04 49.02,52.7 53.34,52.7 | 53.34,52.7 56.05,52.7 C16.1 | 53.34,52.7 U11.8 | C24.1 55.88,40.64 55.12,41.4 53.34,41.4 | 53.34,41.4 51.56,41.4 | U10.8 53.34,41.4 | R43.1 46.35,58.42 | 45.72,26.67 45.72,25.4 45.72,22.86 46.61,21.97 | 58.42,19.05 58.42,20.57 57.78,21.21 50.8,21.21 47.37,21.21 46.61,21.97 | 46.61,17.27 46.61,21.97 | U4.8 19.05,23.11 20.07,22.1 | 20.07,22.1 23.37,22.1 24.51,23.24 | C28.1 20.07,22.1
  Top 0.406: 26.67,34.29 26.67,40.64 26.67,41.91 26.67,46.99 | 26.67,34.29 25.4,33.02 24.83,32.45 | 26.67,34.29 26.67,29.21 | 26.67,29.21 26.67,26.29 24.51,24.13 24.51,23.24 | 25.4,54.61 26.67,53.34 26.67,52.32 26.67,52.07 26.67,46.99 | 26.67,29.21 33.02,29.21 | 33.02,29.21 35.56,26.67 35.56,17.78 | 33.02,29.21 43.18,29.21 | 43.18,29.21 45.72,26.67 | 43.18,29.21 48.64,29.21 50.55,31.11 | 43.18,29.21 45.72,31.75 45.72,33.02 45.72,39.37 | 45.72,39.37 47.75,41.4 51.56,41.4 | 45.72,39.37 45.72,41.91 45.72,44.45 45.72,48.26 46.35,48.9 46.35,50.04 46.35,58.42 46.35,59.05 52.07,64.77 | v30.48,46.99 26.67,46.99
  Top 0.508: v36.83,53.34 39.66,56.17 39.66,58.42 39.66,59.69 39.66,60.07 C29.1 39.66,64.67 C30.1 39.12,65.22 U13.5
  Bottom 0.254: v36.83,53.34 38.1,53.34 40.13,51.31 v40.13,50.42
  Bottom 0.406: v36.83,53.34 36.83,50.8 33.02,46.99 v30.48,46.99
!RESET  (via drill 0.35)
  Top 0.254: U$4.40 31.14,49.51 v31.11,49.53
  Bottom 0.254: v31.11,49.53 31.11,48.77 29.84,47.5 PAD2.1
D+
  Top 0.254: X3.D+ 25.53,65.44 arc45 26.99,61.91 32.17,56.73 arc-45 33.81,52.77 U$4.34
D-
  Top 0.254: X3.D- 26.18,65.33 arc45 27.48,62.18 32.76,56.9 arc-45 34.31,53.16 U$4.33
EN
  Top 0.254: 35.69,63.37 35.94,63.63 35.94,65.28 36.77,66.1 38.29,66.1 38.99,66.8 42.29,66.8 42.93,66.17 44.2,66.17 44.47,66.44 P2.4 | 35.69,63.37 35.56,63.25 34.83,63.25 U13.3 | 35.69,63.37 36.79,62.27 R45.2
GND  (via drill 0.35)  (2 unrouted)
  Top 0.203: U1.1 16.48,60.99
  Top 0.254: C1.2 29.25,50.38 31.12,48.51 U$4.42 35.31,48.51 U$4.THERMAL | v22.73,48.26 23.28,48.81 R30.1 | C26.2 14.26,43.98 15.49,45.21 v15.49,46.61 | v18.03,33.15 17.91,33.02 | R44.1 49.36,56.13 v52.7,56.13 | R32.1 48.93,26.67 v49.66,26.67 | v57.02,16.89 57.19,16.89 C21.2 | v45.47,16.89 46.61,15.75 C19.2 | v34.16,16.76 34.46,16.76 C17.2 | R34.1 30.57,21.8 v30.48,21.72 | 49.72,18.14 49.72,17.97 | v22.73,26.67 22.86,26.8 24.38,26.8 24.98,27.39 R36.1 | 31.58,38.52 31.62,38.48 | 34.63,38.52 34.54,38.61 | v34.54,43.69 34.81,43.95 U$4.5 34.81,47.51 U$4.THERMAL | R42.1 48.68,48.26 v49.66,48.26 | R40.1 48.68,36.83 v49.66,36.83 | v15.37,57.91 14.77,57.32 C27.2 | R26.1 11.21,14.77 v11.18,14.73 | v22.73,16.76 23.33,16.17 C20.2 | C23.2 57.75,29.3 v56.9,28.45 | C24.2 59.27,39.84 58.04,38.61 v57.02,38.61 | v54.23,63.37 55.46,64.6 C25.2 | 24.13,67.18 24.23,67.28 X3.GND 24.23,69.52 X3.BASE@2 X3.BASE@1 | v22.73,36.83 23.71,36.83 R28.1 | U5.17 16.02,18.43 v15.37,17.78 | v15.49,35.05 14.39,33.95 C18.2 | U$4.35 33.31,50.51 U$4.THERMAL | U$4.18 35.81,48.01 U$4.THERMAL
  Top 0.305: U1.1 15.97,60.99 v15.37,61.59 | U1.3 v15.37,59.69 | U1.5 15.85,58.39 v15.37,57.91 | U1.18 19.05,63.37 v19.3,63.63 | U1.17 19.7,63.23 v19.3,63.63 | U1.6 17.75,56.16 v18.03,55.88 18.4,56.25 U1.7 | U1.9 19.7,56.25 v20.07,55.88 20.35,56.16 U1.10 | U1.13 v22.61,59.69 | U2.18 19.05,51.82 v19.3,52.07 19.7,51.67 U2.17 | U2.1 16.1,49.56 v15.49,50.16 | U2.3 v15.49,48.26 | U2.5 15.85,46.96 v15.49,46.61 | U2.7 18.4,44.82 v18.16,44.58 17.75,44.99 U2.6 | U2.9 19.7,44.82 v19.94,44.58 20.35,44.99 U2.10 | v22.73,48.26 U2.13 | U3.18 19.05,40.26 v19.3,40.51 19.7,40.12 U3.17 | v15.49,38.73 16.1,38.13 U3.1 | U3.3 v15.49,36.83 | U3.5 15.97,35.53 v15.49,35.05 | U3.6 17.75,33.43 v18.03,33.15 18.4,33.51 U3.7 | U3.9 19.7,33.39 v19.94,33.15 20.35,33.56 U3.10 | U3.13 v22.73,36.83 | U4.18 19.05,30.1 v19.3,30.35 19.7,29.96 U4.17 | v15.49,28.57 16.1,27.97 U4.1 | U4.3 15.62,26.67 v15.49,26.54 | U4.5 16.35,25.37 v15.49,24.51 15.49,23.2 C28.2 | U4.13 v22.73,26.67 | U4.7 18.4,23.62 17.65,23.62 | v17.02,23.37 17.27,23.62 17.65,23.62 | U4.6 17.75,23.72 17.65,23.62 | U4.9 19.7,23.84 19.83,23.71 20.86,23.71 v21.08,23.5 20.83,23.75 20.35,23.75 U4.10 | v19.05,21.21 U5.13 | v15.37,17.78 U5.18 | U5.6 22.45,16.48 22.67,16.7 | 22.67,16.7 v22.73,16.76 | U5.7 22.24,17.13 22.67,16.7 | U5.10 22.45,19.08 22.67,18.86 | 22.67,18.86 v22.73,18.8 | U5.9 22.24,18.43 22.67,18.86 | U5.1 17.75,14.83 v17.14,14.22 | U5.3 v19.05,14.22 | U5.5 20.35,14.7 v20.83,14.22 | v38.23,18.03 38.62,18.43 U7.17 | U7.18 38.48,17.78 v38.23,18.03 | U7.7 45.23,17.13 v45.47,16.89 45.05,16.48 U7.6 | U7.9 45.23,18.43 v45.59,18.8 45.31,19.08 U7.10 | U7.3 v41.91,14.22 | U7.1 40.61,14.83 v40.01,14.22
  Top 0.305: U7.5 43.21,14.7 v43.69,14.22 | U7.13 v41.91,21.21 | U6.9 33.8,18.43 v34.16,18.8 33.88,19.08 U6.10 | U6.7 33.8,17.13 v34.16,16.76 33.88,16.48 U6.6 | U6.5 31.78,14.7 v32.26,14.22 | U6.3 v30.48,14.22 | U6.1 29.18,14.83 v28.57,14.22 | U6.18 27.18,17.78 v26.8,18.16 27.07,18.43 U6.17 | U6.13 v30.48,21.72 | U10.10 52.04,40.23 v52.32,40.51 52.69,40.15 U10.9 | U10.7 53.99,40.27 v54.23,40.51 54.64,40.1 U10.6 | U10.13 v49.66,36.83 | U10.18 53.34,33.53 v53.09,33.27 52.69,33.67 U10.17 | U10.1 56.16,35.53 v56.9,34.8 | U10.3 v56.9,36.83 | U10.5 56.55,38.13 v57.02,38.61 | U9.13 v49.66,26.67 | U9.10 52.04,30.07 v52.32,30.35 52.69,29.99 U9.9 | U9.7 53.99,29.99 v54.36,30.35 54.64,30.07 U9.6 | U9.5 56.42,27.97 v56.9,28.45 | U9.3 56.77,26.67 v56.9,26.54 | U9.1 56.65,24.51 v56.9,24.51 | U9.17 52.69,23.38 v52.96,23.11 53.34,23.5 U9.18 | U8.9 56.78,18.43 v57.02,18.67 56.61,19.08 U8.10 | U8.7 56.78,17.13 v57.02,16.89 56.61,16.48 U8.6 | U8.5 54.64,14.7 v55.12,14.22 | U8.3 v53.34,14.22 | U8.1 52.04,14.83 v51.44,14.22 | U8.18 49.91,17.78 49.72,17.97 | 49.72,17.97 v49.66,18.03 | U8.17 50.18,18.43 49.72,17.97 | U12.9 52.69,63.13 v52.45,63.37 52.04,62.96 U12.10 | U12.7 53.99,63.13 v54.23,63.37 54.64,62.96 U12.6 | U12.13 v49.66,59.69 | U12.17 v52.69,56.13 v52.7,56.13 53.34,56.77 U12.18 | U12.1 56.29,58.39 v56.9,57.78 | U12.3 v56.9,59.69 | U12.5 56.8,60.99 v56.9,61.09 | U11.9 52.69,51.7 v52.45,51.94 52.04,51.53 U11.10 | U11.7 53.99,51.58 v54.36,51.94 54.64,51.66 U11.6 | U11.3 v56.9,48.26 | U11.5 56.8,49.56 v56.9,49.66 56.9,51.6 C16.2 | U11.1 56.29,46.96 v56.9,46.35 | U11.17 52.69,44.85 v52.96,44.58 53.34,44.96 U11.18 | U11.13 v49.66,48.26
  Top 0.305: U1.16 20.32,62.17 20.32,63.5 20.19,63.63 v19.3,63.63 | U7.16 39.43,19.05 38.61,19.05 38.23,18.67 v38.23,18.03 | U8.13 U8.27 | X3.GND 24.23,66.14 23.75,65.66 v23.5,65.66
  Top 0.406: P2.1 48.26,67.65 48.26,66.17 v48.39,66.04 | U13.2 33.72,64.26 33.54,64.08 33.53,64.08 C22.2
  Top 0.508: v32.64,61.85 C22.2 31.31,63.19 v31.24,63.12 | C29.2 41.36,64.22 v41.4,64.26 | v43.05,64.9 42.29,65.66 C30.2
  other vias: 24.64,65.02 24.77,63.88 25.15,62.87 25.65,61.85 26.42,60.96 27.3,60.2 28.07,59.31 28.83,58.55 29.59,57.78 30.48,56.9 31.37,56.01 32.13,55.12 32.64,54.23 34.29,56.52 33.53,57.4 32.77,58.17 32,58.93 31.11,59.69 30.23,60.58 29.46,61.34 28.7,62.23 27.94,62.99 27.3,64.14 26.92,65.28 34.67,55.5
  pour Bottom (isolate 0.305): -3.81,76.2 73.66,76.2 73.66,-1.27 -3.81,-1.27
  pour Top: 35.56,44.45 36.83,43.18 36.83,38.1 35.56,36.83 30.48,36.83 29.46,37.85 29.46,43.18 30.73,44.45
N$5
  Top 0.254: U$4.1 32.81,42.9 X2.P$1 31.82,41.56 C2.1
N$6
  Top 0.508: J6.1 7.24,60.54 R1.1
N$7
  Top 0.254: U$4.2 33.31,42.82 X2.P$2 34.22,41.56 C4.1
N$8
  Top 0.508: J6.2 6.73,55.03 R2.1
N$9
  Top 0.508: J9.1 7.24,49.11 R3.1
N$10
  Top 0.508: J9.2 6.73,43.6 R4.1
N$11
  Top 0.508: R5.1 27.09,5.97 J10.1
N$12
  Top 0.508: J10.2 33.87,5.97 R6.1
N$13
  Top 0.508: R7.1 65.62,55.03 67.27,53.38 J11.1
N$14
  Top 0.508: J11.2 66.85,58.84 R8.1
N$15
  Top 0.508: R9.1 62.61,41.95 J8.1
N$16
  Top 0.508: J8.2 65.15,49.11 R10.1
N$17
  Top 0.508: J7.2 9.78,30.52 R11.1
N$18
  Top 0.508: J7.1 7.24,37.68 R12.1
N$19
  Top 0.254: U3.2 15.96,37.48 15.77,37.68 C6.1
  Top 0.508: R12.2 11.81,35.98 13.76,37.93 13.76,37.42 13.97,37.63 C6.1
N$20
  Top 0.254: U3.4 15.96,36.18 15.77,35.98 C6.2
  Top 0.508: C6.2 13.97,35.9 11.94,33.87 R11.2
N$21
  Top 0.254: U1.4 15.65,59.04 15.51,58.91 14.04,58.91 C3.2
  Top 0.508: R2.2 13.54,58.84 C3.2
N$22
  Top 0.508: J1.1 6.31,24.09 8.47,26.25 R13.1
N$23
  Top 0.254: U1.2 15.65,60.34 15.51,60.48 14.04,60.48 C3.1
  Top 0.508: R1.2 11.63,58.84 13.34,60.54 C3.1
N$24
  Top 0.254: U2.2 15.77,48.91 15.77,48.92 13.78,48.92 13.59,49.11
  Top 0.508: R3.2 11.89,47.41 13.59,49.11 C5.1
N$25
  Top 0.508: J1.2 7.66,19.09 9.31,20.74 R14.1
N$26
  Top 0.254: U2.4 15.84,47.61 15.64,47.41 C5.2
  Top 0.508: R4.2 11.86,45.3 C5.2
N$27
  Top 0.254: U6.2 29.83,14.72 29.59,14.48 29.59,12.74 C8.1
  Top 0.508: R5.2 29.68,11.05 29.68,12.65 C8.1
N$28
  Top 0.508: R23.1 49.95,5.97 J12.1
N$29
  Top 0.254: U6.4 31.13,14.5 31.14,14.5 31.14,14.46 31.33,14.26 C8.2
  Top 0.508: R6.2 31.33,11 C8.2
N$30
  Top 0.254: U12.2 56.42,59.04 56.62,58.84 C9.1
  Top 0.508: C9.1 60.53,56.73 R7.2
N$31
  Top 0.254: C9.2 57.28,60.54 57.17,60.43 55.88,60.43 U12.4
  Top 0.508: R8.2 C9.2
N$32
  Top 0.254: U4.2 14.62,27.32 13.97,26.67 C10.1
  Top 0.508: R13.2 11.76,24.55 13.46,26.25 C10.1
N$33
  Top 0.254: U11.4 56.62,48.91 56.62,48.92 58.23,48.92 C7.2
  Top 0.508: R10.2 60.71,47.41 59.01,49.11 C7.2
N$34
  Top 0.254: U4.4 16.22,26.02 16.01,25.81 15.48,25.81 14.22,24.55 C10.2
  Top 0.508: C10.2 13.97,23.96 12.45,22.44 R14.2
N$35
  Top 0.254: U11.2 56.62,47.61 56.62,47.6 58.23,47.6 C7.1
  Top 0.508: C7.1 58.42,46.7 59.82,45.3 R9.2
N$36
  Top 0.508: J2.1 15.66,5.97 R15.1
N$37
  Top 0.508: J2.2 22.44,5.97 R16.1
N$38
  Top 0.508: R17.1 62.61,19.09 J3.1
N$39
  Top 0.508: R18.1 65.15,26.25 J3.2
N$40
  Top 0.508: J4.2 44.41,9.27 R19.1
N$41
  Top 0.508: R20.1 38.52,5.97 J4.1
N$42
  Top 0.508: J5.2 65.15,37.68 R21.1
N$43
  Top 0.508: R22.1 62.61,30.52 J5.1
N$44
  Top 0.508: R24.1 56.73,5.97 J12.2
N$45
  Top 0.254: U7.2 41.26,14.72 41.02,14.48 41.02,12.74 C12.1
  Top 0.508: C12.1 41.06,11 R20.2
N$46
  Top 0.254: U7.4 42.56,14.5 42.57,14.5 42.57,14.46 42.8,14.22 42.8,12.74 C12.2
  Top 0.508: R19.2 43.52,10.16 42.76,10.92 C12.2
N$47
  Top 0.254: U8.2 52.69,14.5 52.68,14.5 52.68,14.46 52.45,14.22 52.45,12.74 C15.1
  Top 0.508: R23.2 52.49,11 C15.1
N$48
  Top 0.254: U10.4 56.62,37.48 56.75,37.62 58.35,37.62 C14.2
  Top 0.508: R21.2 60.45,35.98 58.75,37.68 C14.2
N$49
  Top 0.254: U8.4 53.99,14.59 54.19,14.39 C15.2
  Top 0.508: C15.2 54.19,11.05 55.03,10.21 R24.2
N$50
  Top 0.254: U10.2 56.42,36.18 56.62,35.98 C14.1
  Top 0.508: C14.1 58.42,35.6 60.15,33.87 R22.2
N$51
  Top 0.254: U9.2 56.36,26.02 56.75,25.63 57.34,25.63 C13.1
  Top 0.508: C13.1 58.42,24.04 60.02,22.44 R17.2
N$52
  Top 0.254: R27.2 R28.2 21.12,40.26 20.7,40.26 20.35,39.91 U3.16
N$53
  Top 0.254: U9.4 57.35,27.32 C13.2
  Top 0.508: R18.2 60.71,24.8 60.25,24.8 58.8,26.25 C13.2
N$54
  Top 0.254: U5.2 18.4,14.59 18.16,14.35 18.16,12.74 C11.1
  Top 0.508: R15.2 18.2,11 C11.1
N$55
  Top 0.254: U5.4 19.7,14.59 19.9,14.39 C11.2
  Top 0.508: R16.2 19.9,11 C11.2
N$56
  Top 0.254: R30.2 23.28,51.23 R29.2 20.95,52.07 20.32,51.44 20.32,50.74 U2.16
N$57
  Top 0.254: R25.2 12.91,16.71 R26.2 14.71,18.05 15.74,19.08 U5.16
N$58
  Top 0.254: U9.16 51.34,23.52 51.29,23.52 51.27,23.5 50.13,23.5 R31.2 48.98,25.27 48.45,26.33 R32.2
N$59
  Top 0.254: R34.2 28.92,24.21 R33.2 27.3,20.36 27.3,19.56 27.78,19.08 U6.16
N$60
  Top 0.254: U4.16 20.35,29.75 21.08,30.48 R35.2 R36.2
N$62
  Top 0.254: R40.2 R39.2 50.68,33.02 U10.16
N$63
  Top 0.254: R42.2 R41.2 50.68,44.45 U11.16
N$64
  Top 0.254: R44.2 47.41,56.72 R43.2 50.16,57.37 50.16,56.9 50.52,56.54 51.69,56.54 52.04,56.89 U12.16
RX
  Top 0.254: 45.98,67.43 P2.3 45.72,66.29 45.21,65.79 45.21,51.94 40.28,47.01 U$4.16
SCL1  (via drill 0.35)
  Top 0.254: U$4.32 34.81,54.11 v35.56,54.86 35.56,58.93 36.2,59.56 R38.2 | U6.19 28.02,17.14 26.67,17.14 26.14,17.68 26.14,20.04 v26.29,20.19 25.78,20.7 v25.78,21.97 | U5.19 14.96,17.12 v14.73,16.89 | U4.19 18.4,30.78 18.76,31.14 20.42,31.14 v20.57,30.99 | v19.81,41.63 19.77,41.68 19.2,41.68 18.29,40.77 18.29,39.39 U3.19 | v20.95,53.09 18.92,53.09 18.4,52.56 U2.19 | v19.05,64.77 18.4,64.12 U1.19
  Bottom 0.254: v35.56,54.86 35.69,54.74 38.99,54.74 41.53,52.2 41.53,35.56 26.29,20.32 v26.29,20.19 26.29,20.15 25.67,19.54 24.53,19.54 22.1,21.97 17.02,21.97 14.35,19.3 14.35,17.27 v14.73,16.89 | v25.78,21.97 25.15,21.34 24.51,21.34 24.03,21.82 24.03,28.55 21.59,30.99 v20.57,30.99 20.57,31.37 24.38,35.18 24.38,40.01 22.86,41.53 19.92,41.53 v19.81,41.63 19.81,42.42 24.38,46.99 24.38,52.7 23.88,53.21 21.08,53.21 v20.95,53.09 20.95,53.98 23.5,56.52 23.5,62.48 20.95,65.02 19.18,65.02 19.05,64.9 v19.05,64.77
SCL2  (via drill 0.35)
  Top 0.254: U$4.26 37.81,52.54 40.64,55.37 v42.8,55.37 43.69,56.26 43.69,57.53 43.31,57.91 R47.2 | v51.94,55.37 53,55.37 53.99,56.36 U12.19 | v52.32,32.51 52.45,32.38 53.59,32.38 53.99,32.78 U10.19 | v51.56,22.86 51.56,22.73 51.94,22.35 53.59,22.35 53.99,22.75 U9.19 | v37.27,19.62 37.27,17.84 37.99,17.13 U7.19
  Top 0.305: U11.19 53.99,44.08 v53.47,43.56 | v49.02,18.92 48.9,18.8 48.9,17.53 49.29,17.13 U8.19
  Bottom 0.254: v51.94,55.37 v42.8,55.37 | v53.47,43.56 53.47,42.97 49,38.5 49,36.56 49.02,36.53 49.02,33.78 50.29,32.51 v52.32,32.51 52.32,31.88 48.77,28.32 48.77,24.26 50.16,22.86 v51.56,22.86 | v49.02,18.92 48.22,18.92 47.6,19.54 47.6,19.58 44.96,22.23 40.01,22.23 37.34,19.56 v37.27,19.62
  Bottom 0.305: v51.94,55.37 51.94,54.36 48.64,51.05 48.64,45.21 50.29,43.56 v53.47,43.56 | v51.56,22.86 51.56,21.46 v49.02,18.92
SDA1  (via drill 0.35)
  Top 0.254: U$4.31 35.31,53.47 v35.69,53.85 36.62,54.78 R37.2 | U6.20 26.45,16.48 25.65,17.27 25.65,19.81 v25.15,20.32 25.15,21.21 24.77,21.59 v24.77,22.35 | v14.48,15.75 14.86,15.75 15.62,16.51 16.57,16.51 U5.20 | v22.1,31.75 18.67,31.75 17.75,30.83 U4.20 | v21.08,42.42 18.8,42.42 17.75,41.37 U3.20 | v22.09,53.88 22.06,53.85 18.67,53.85 17.75,52.93 U2.20 | v20.32,65.79 18.41,65.79 17.78,65.15 17.78,62.17 U1.20
  Bottom 0.254: v35.69,53.85 35.94,54.1 38.48,54.1 40.89,51.69 40.89,36.07 v25.15,20.32 24.64,20.32 22.33,22.63 16.79,22.63 13.72,19.56 13.72,16.51 v14.48,15.75 | v24.77,22.35 24.77,29.08 v22.1,31.75 25.15,34.8 25.15,40.39 23.11,42.42 v21.08,42.42 21.08,42.67 25.15,46.74 25.15,52.96 24.13,53.98 22.18,53.98 v22.09,53.88 24.13,55.92 24.13,62.74 21.08,65.79 v20.32,65.79
SDA2  (via drill 0.35)
  Top 0.254: U$4.25 38.31,52.41 40.39,54.48 43.56,54.48 v43.81,54.23 44.32,54.74 44.32,59.18 43.94,59.56 R46.2 | U12.20 54.64,56.04 52.83,54.23 v50.67,54.23 | v51.18,31.77 53.94,31.77 54.64,32.48 U10.20 | v50.67,21.97 50.8,21.84 53.85,21.84 54.64,22.64 U9.20 | v36.76,20.39 36.62,20.25 36.62,17.74 37.88,16.48 U7.20
  Top 0.305: U11.20 54.74,45.71 54.74,43.56 53.98,42.8 v52.2,42.8 | U8.20 48.92,16.48 48.26,17.14 v48.26,19.81
  Bottom 0.254: v50.67,54.23 v43.81,54.23 | v52.2,42.8 48.26,38.86 48.26,33.53 50.04,31.75 51.18,31.75 v51.18,31.77 48.13,28.73 48.13,23.88 50.04,21.97 v50.67,21.97 | v48.26,19.81 45.21,22.86 39.37,22.86 36.76,20.25 v36.76,20.39
  Bottom 0.305: v50.67,54.23 47.88,51.44 47.88,44.96 50.04,42.8 v52.2,42.8 | v50.67,21.97 48.51,19.81 v48.26,19.81
SWCLK  (via drill 0.35)
  Top 0.254: U$4.45 32.06,46.99 31.54,46.99 30.33,45.78 v30.29,45.78
  Bottom 0.254: v30.29,45.78 28.51,45.78 PAD3.1
SWDIO  (via drill 0.35)
  Top 0.254: U$4.46 31.65,46.51 31.11,45.97 31.11,45.47 30.61,44.96 30.1,44.96 30.1,44.91 v30.13,44.88
  Bottom 0.254: v30.13,44.88 v30.13,44.86 29.46,44.2 PAD4.1
TX
  Top 0.254: 46.99,67.67 P2.2 46.97,66.55 45.7,65.28 45.7,51.86 40.35,46.51 U$4.15
VBAT
  Top 0.508: P2.5 42.46,68.45 37.66,68.45 D1.A
VBUS
  Top 0.254: R45.1 34.94,61.19 31.99,61.19 30.48,62.7 30.48,65.15
  Top 0.305: X3.VBUS 26.83,67.15 27.94,66.04
  Top 0.406: D1.C 33.08,66.91 U13.1 32.77,65.21 C22.1 | 30.66,65.15 28.83,65.15 27.94,66.04
  Top 0.508: D1.C 30.66,65.15 30.48,65.15
VDDCORE
  Top 0.254: C1.1 29.88,48.01 U$4.43